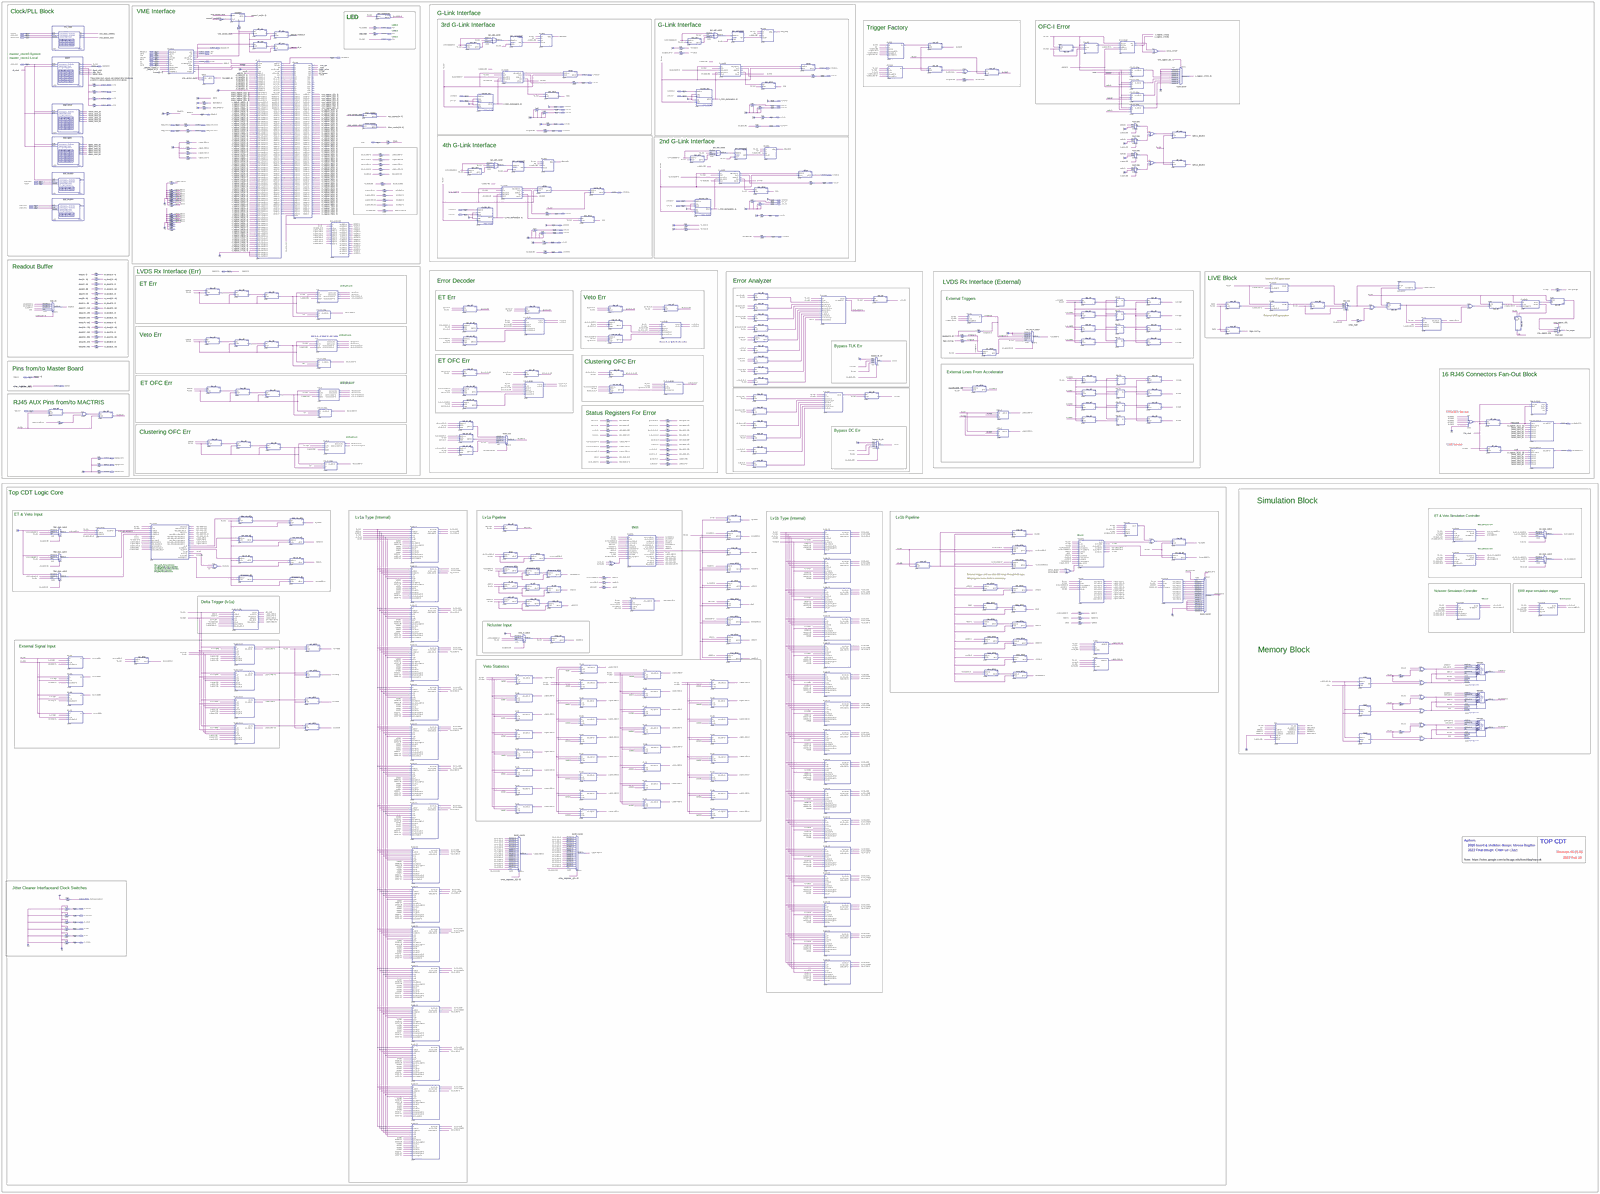
[diagram p0: schematic sheet, whole]
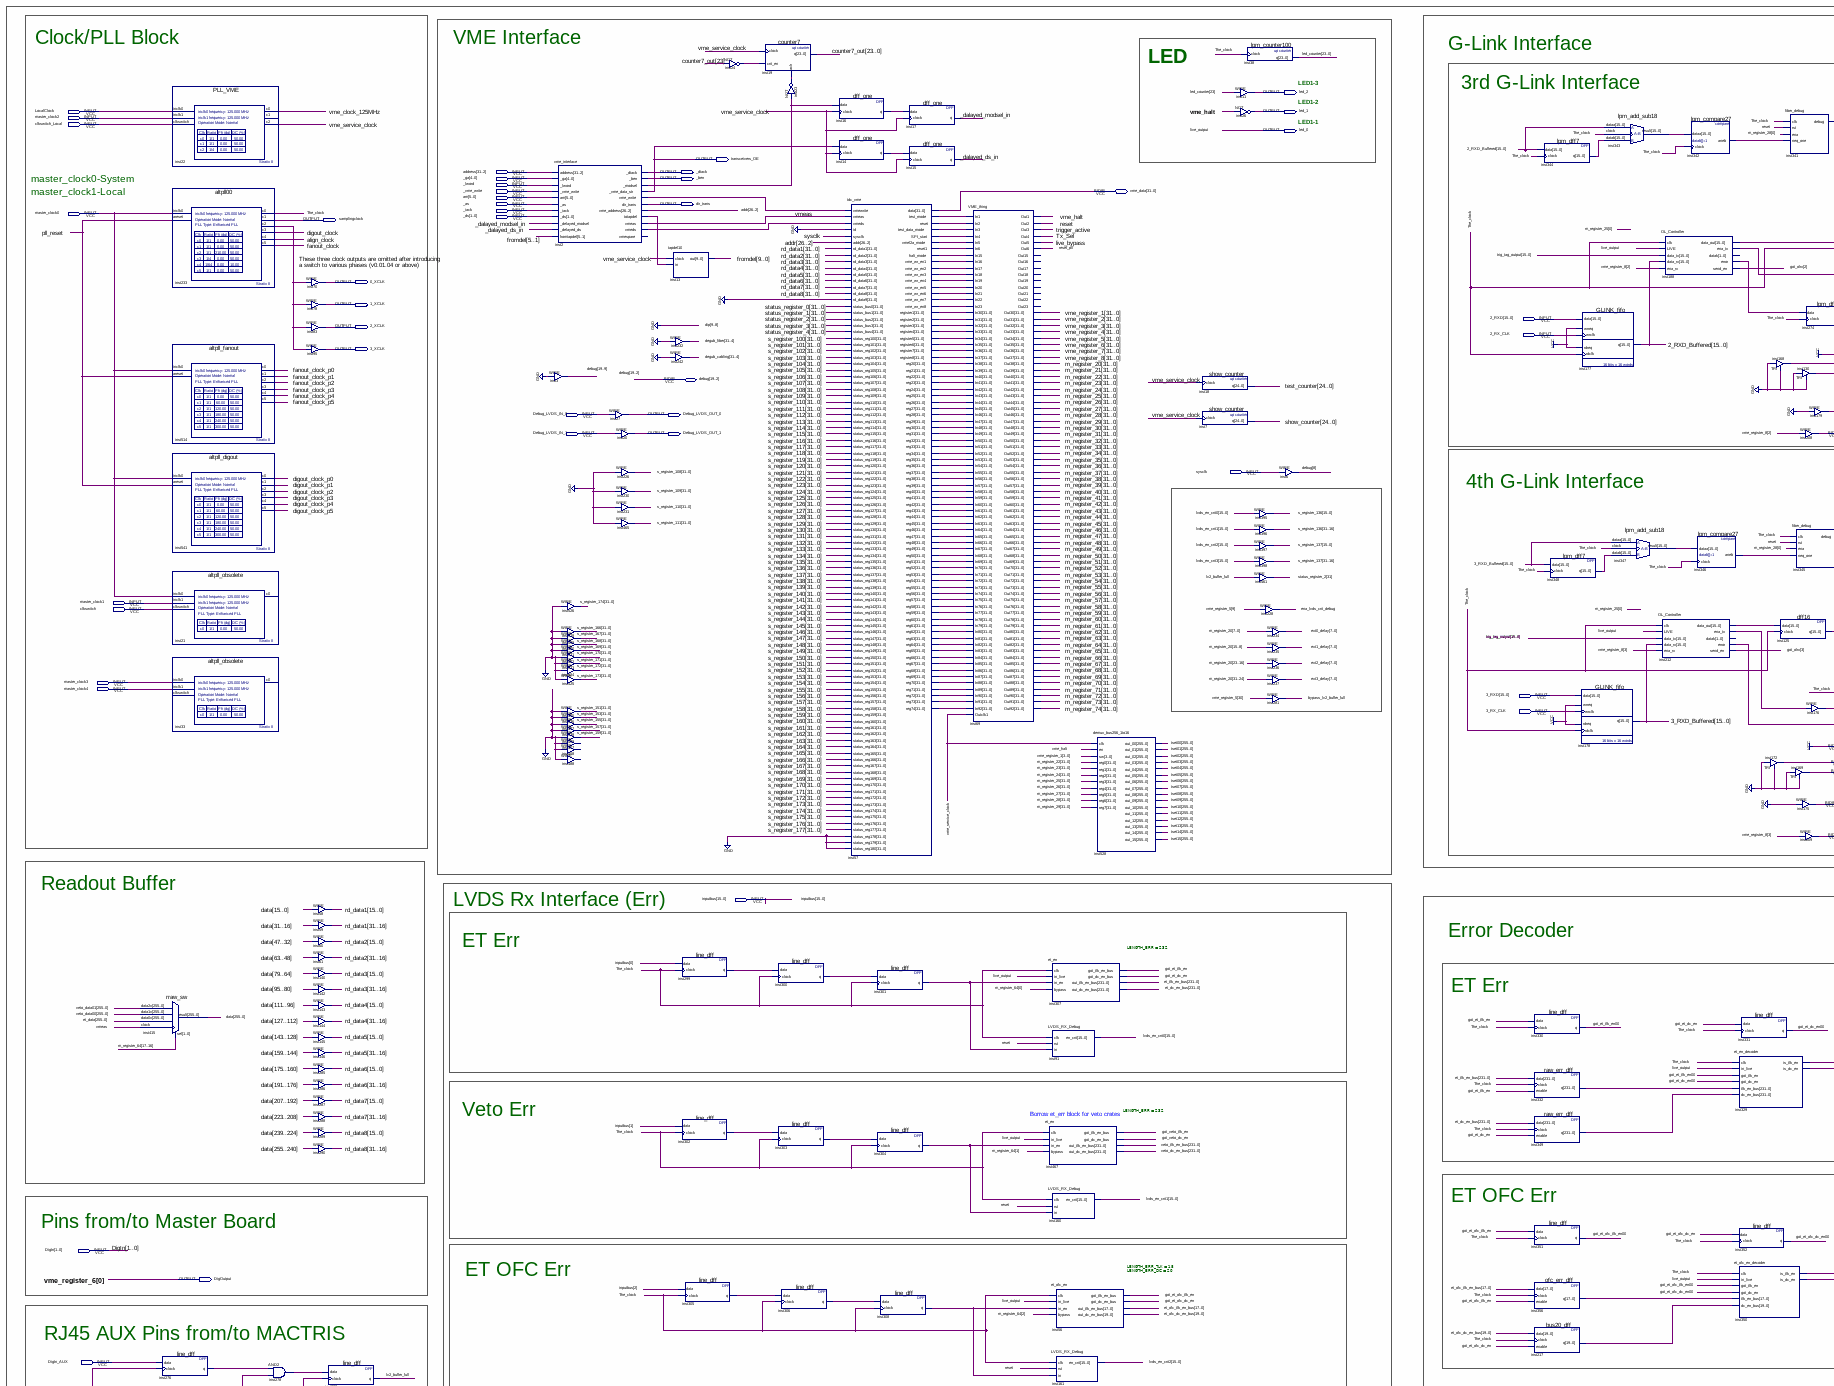
[diagram p1: schematic sheet, upper left part]
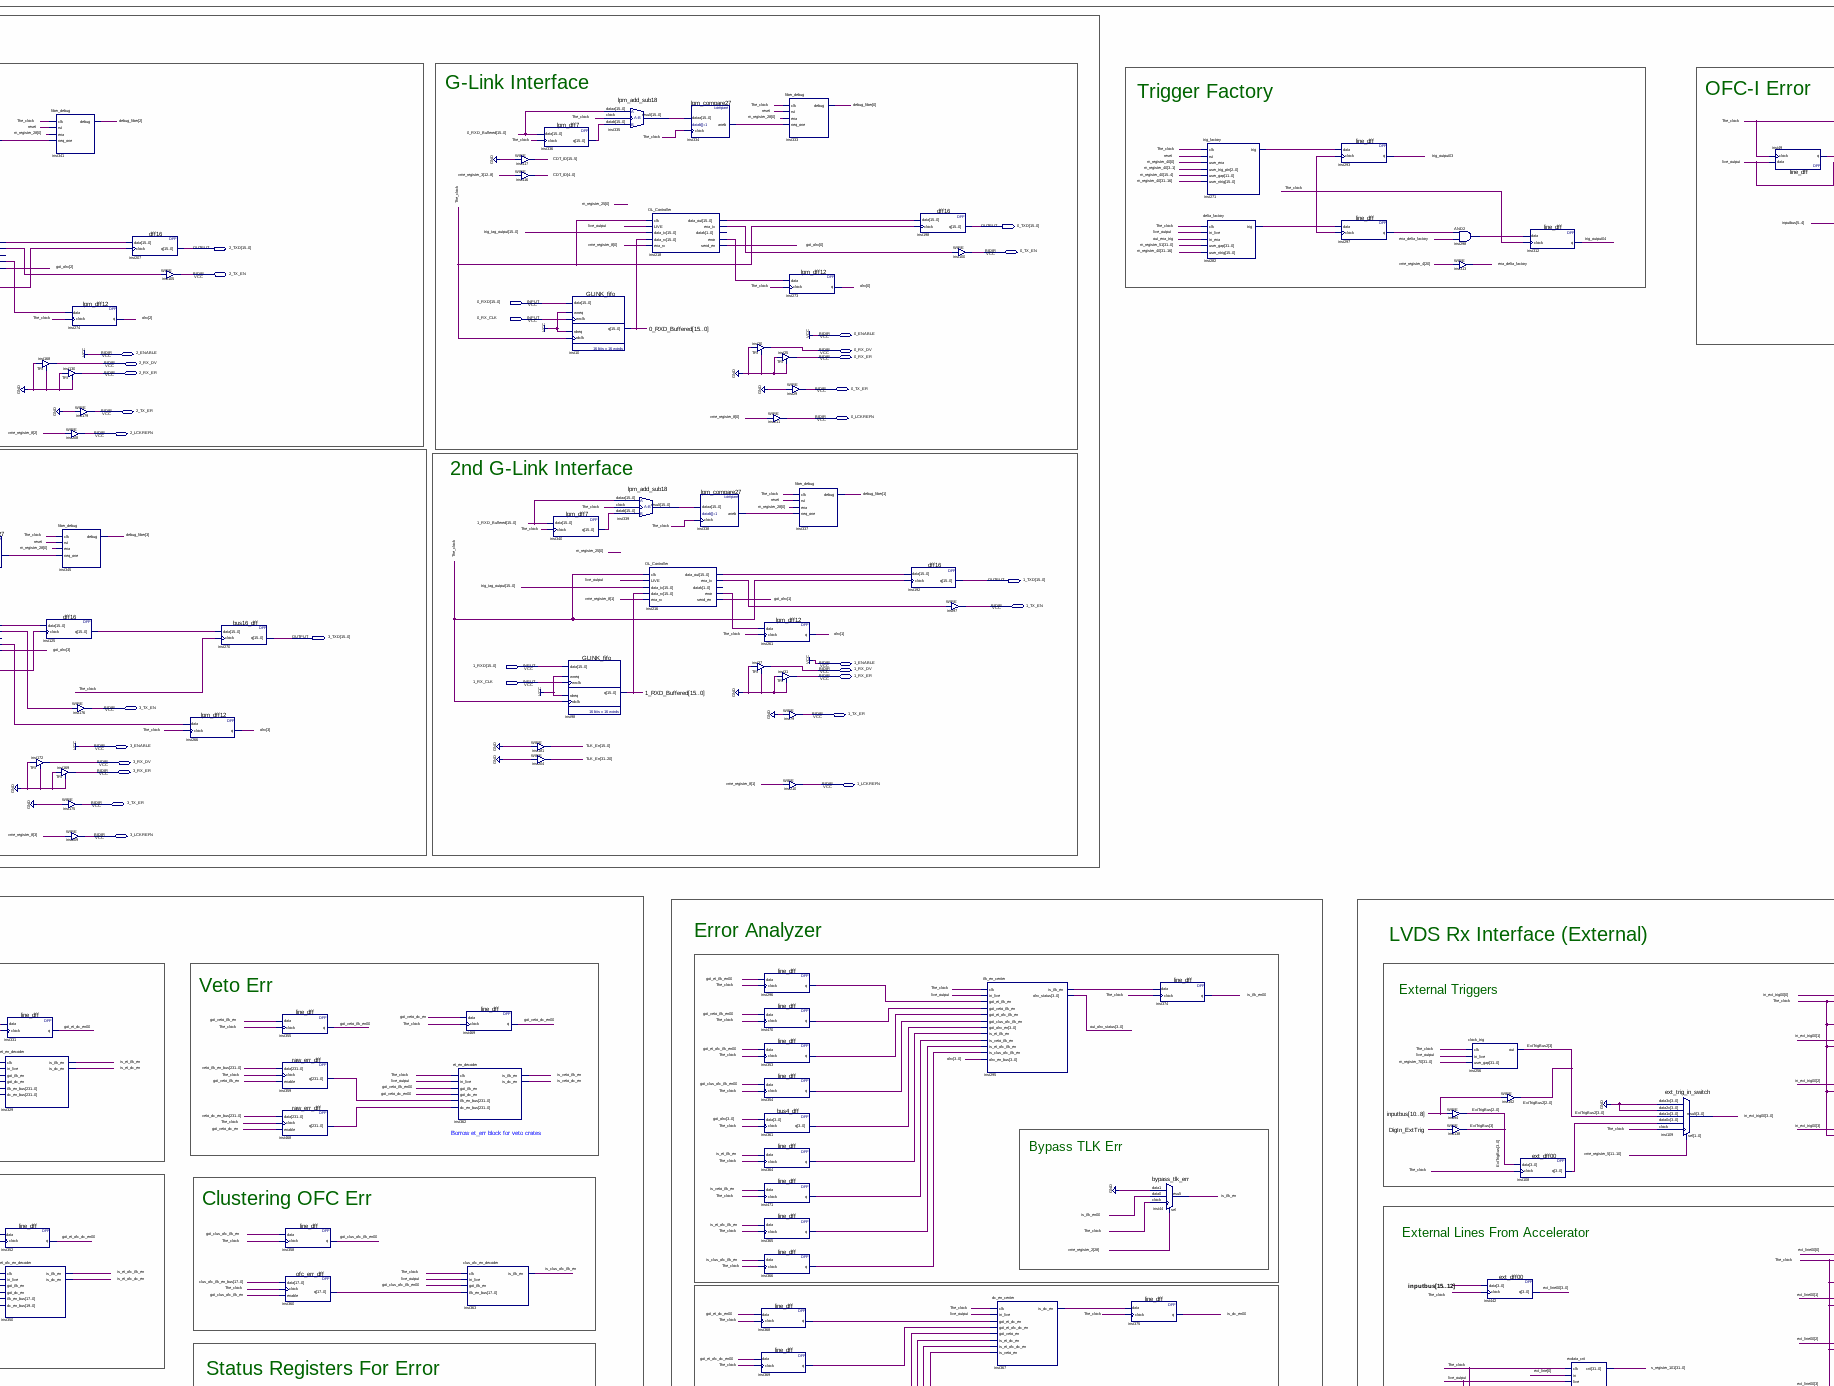
[diagram p2: schematic sheet, upper centre part]
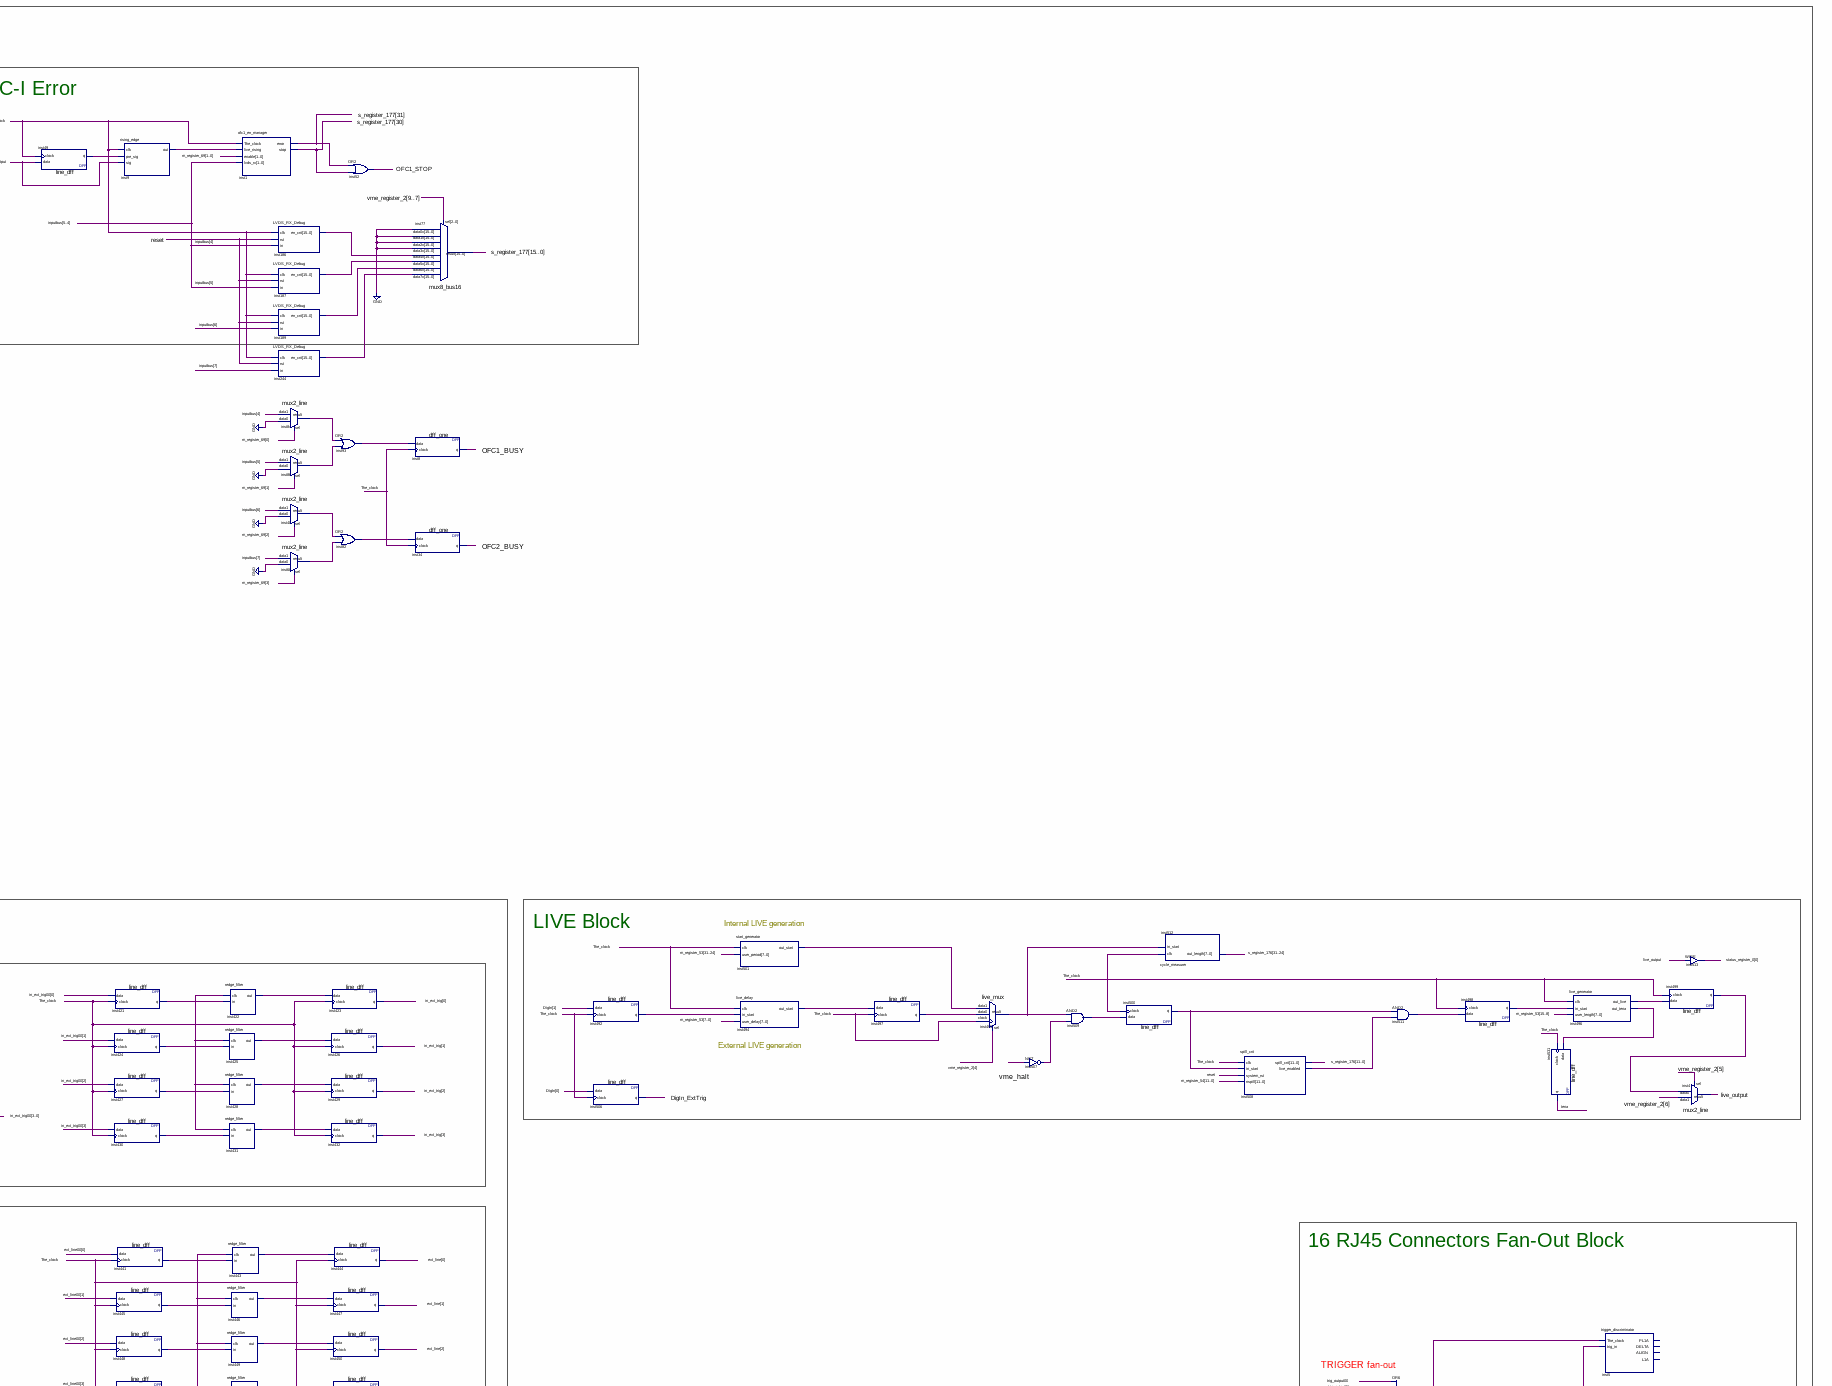
[diagram p3: schematic sheet, upper right part]
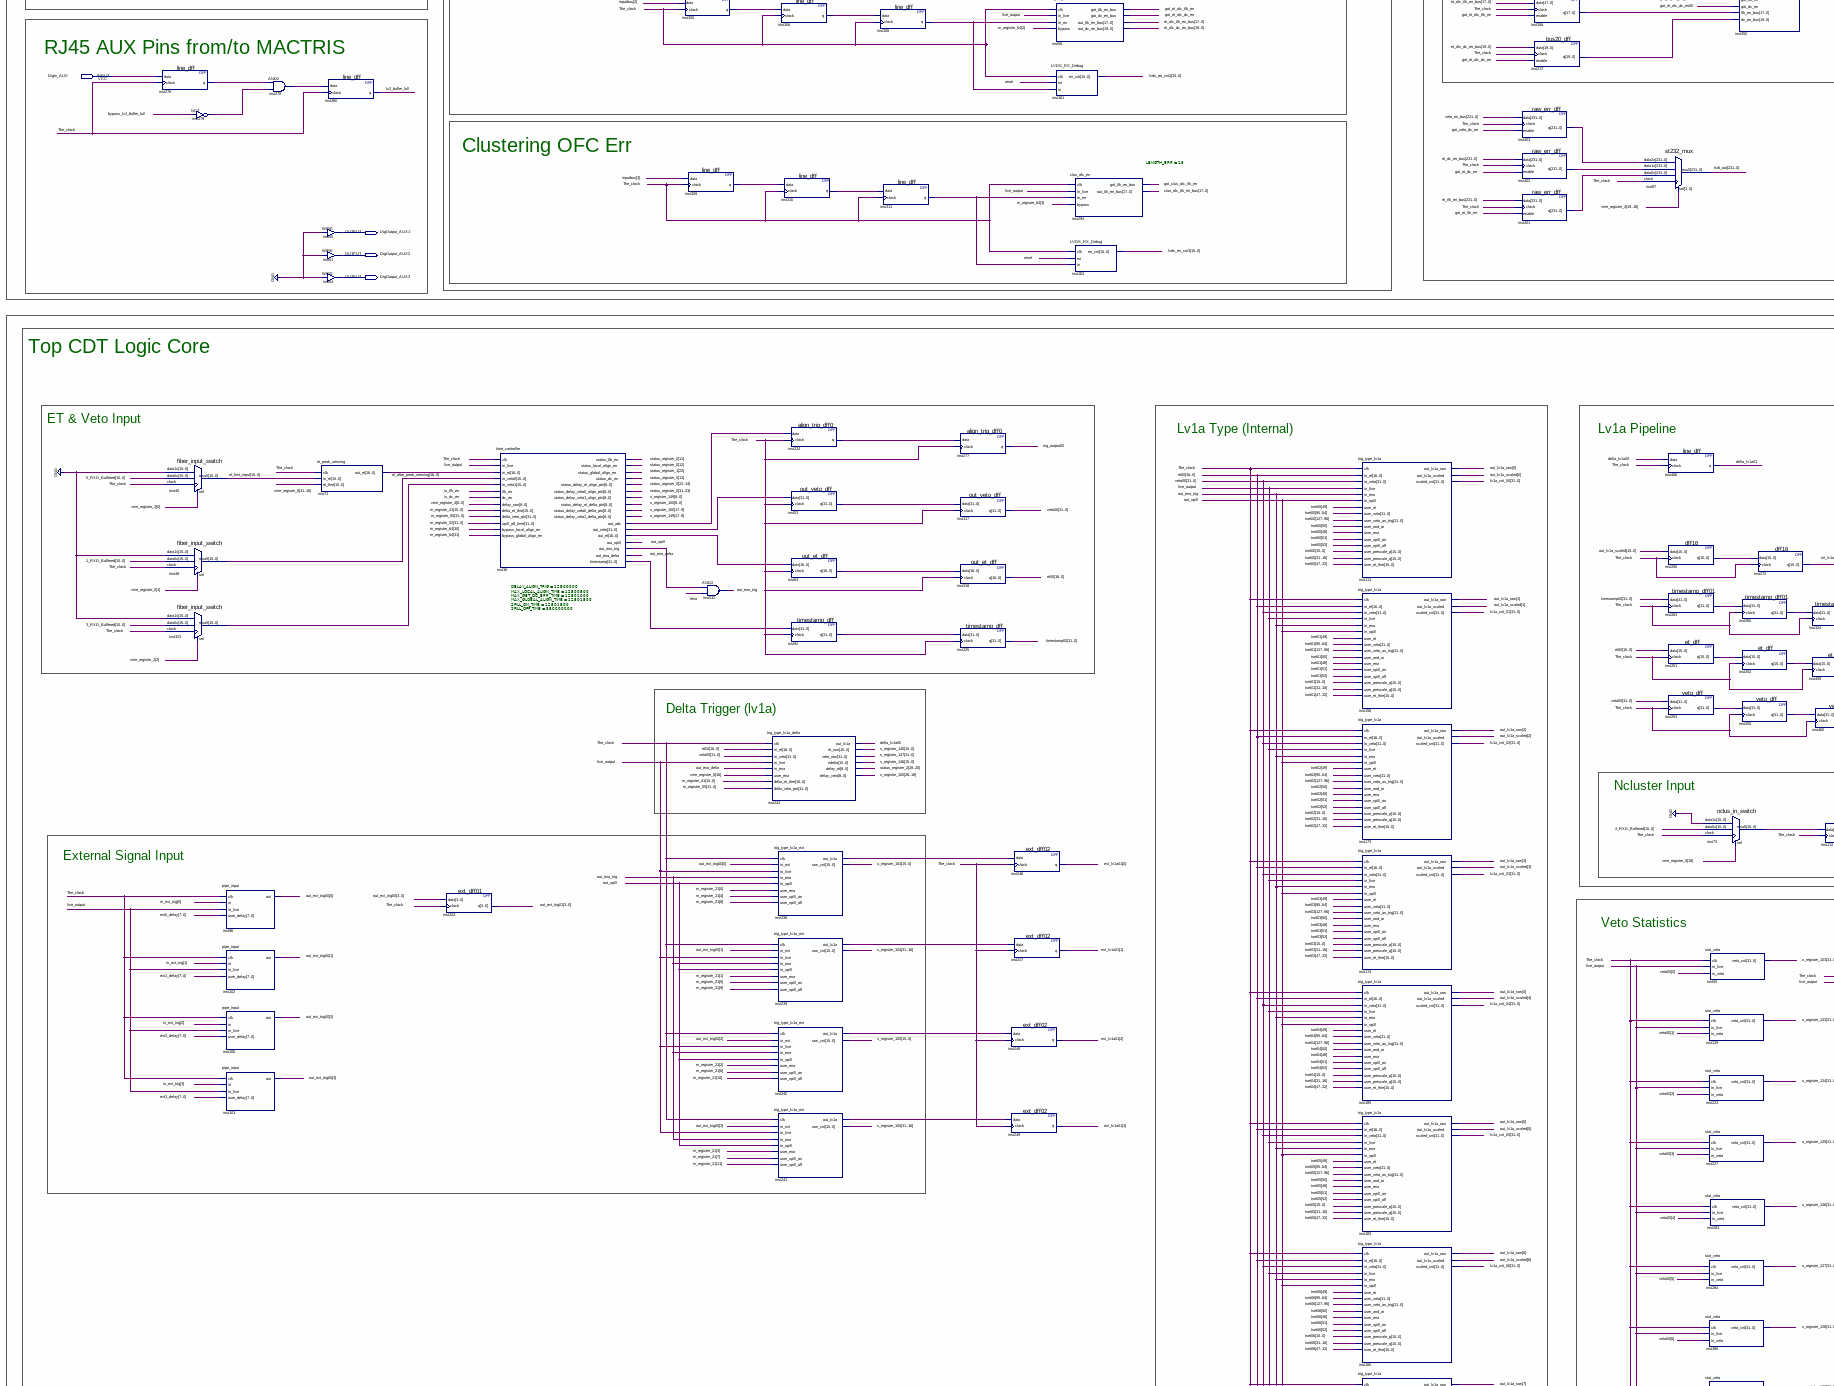
[diagram p4: schematic sheet, middle left part]
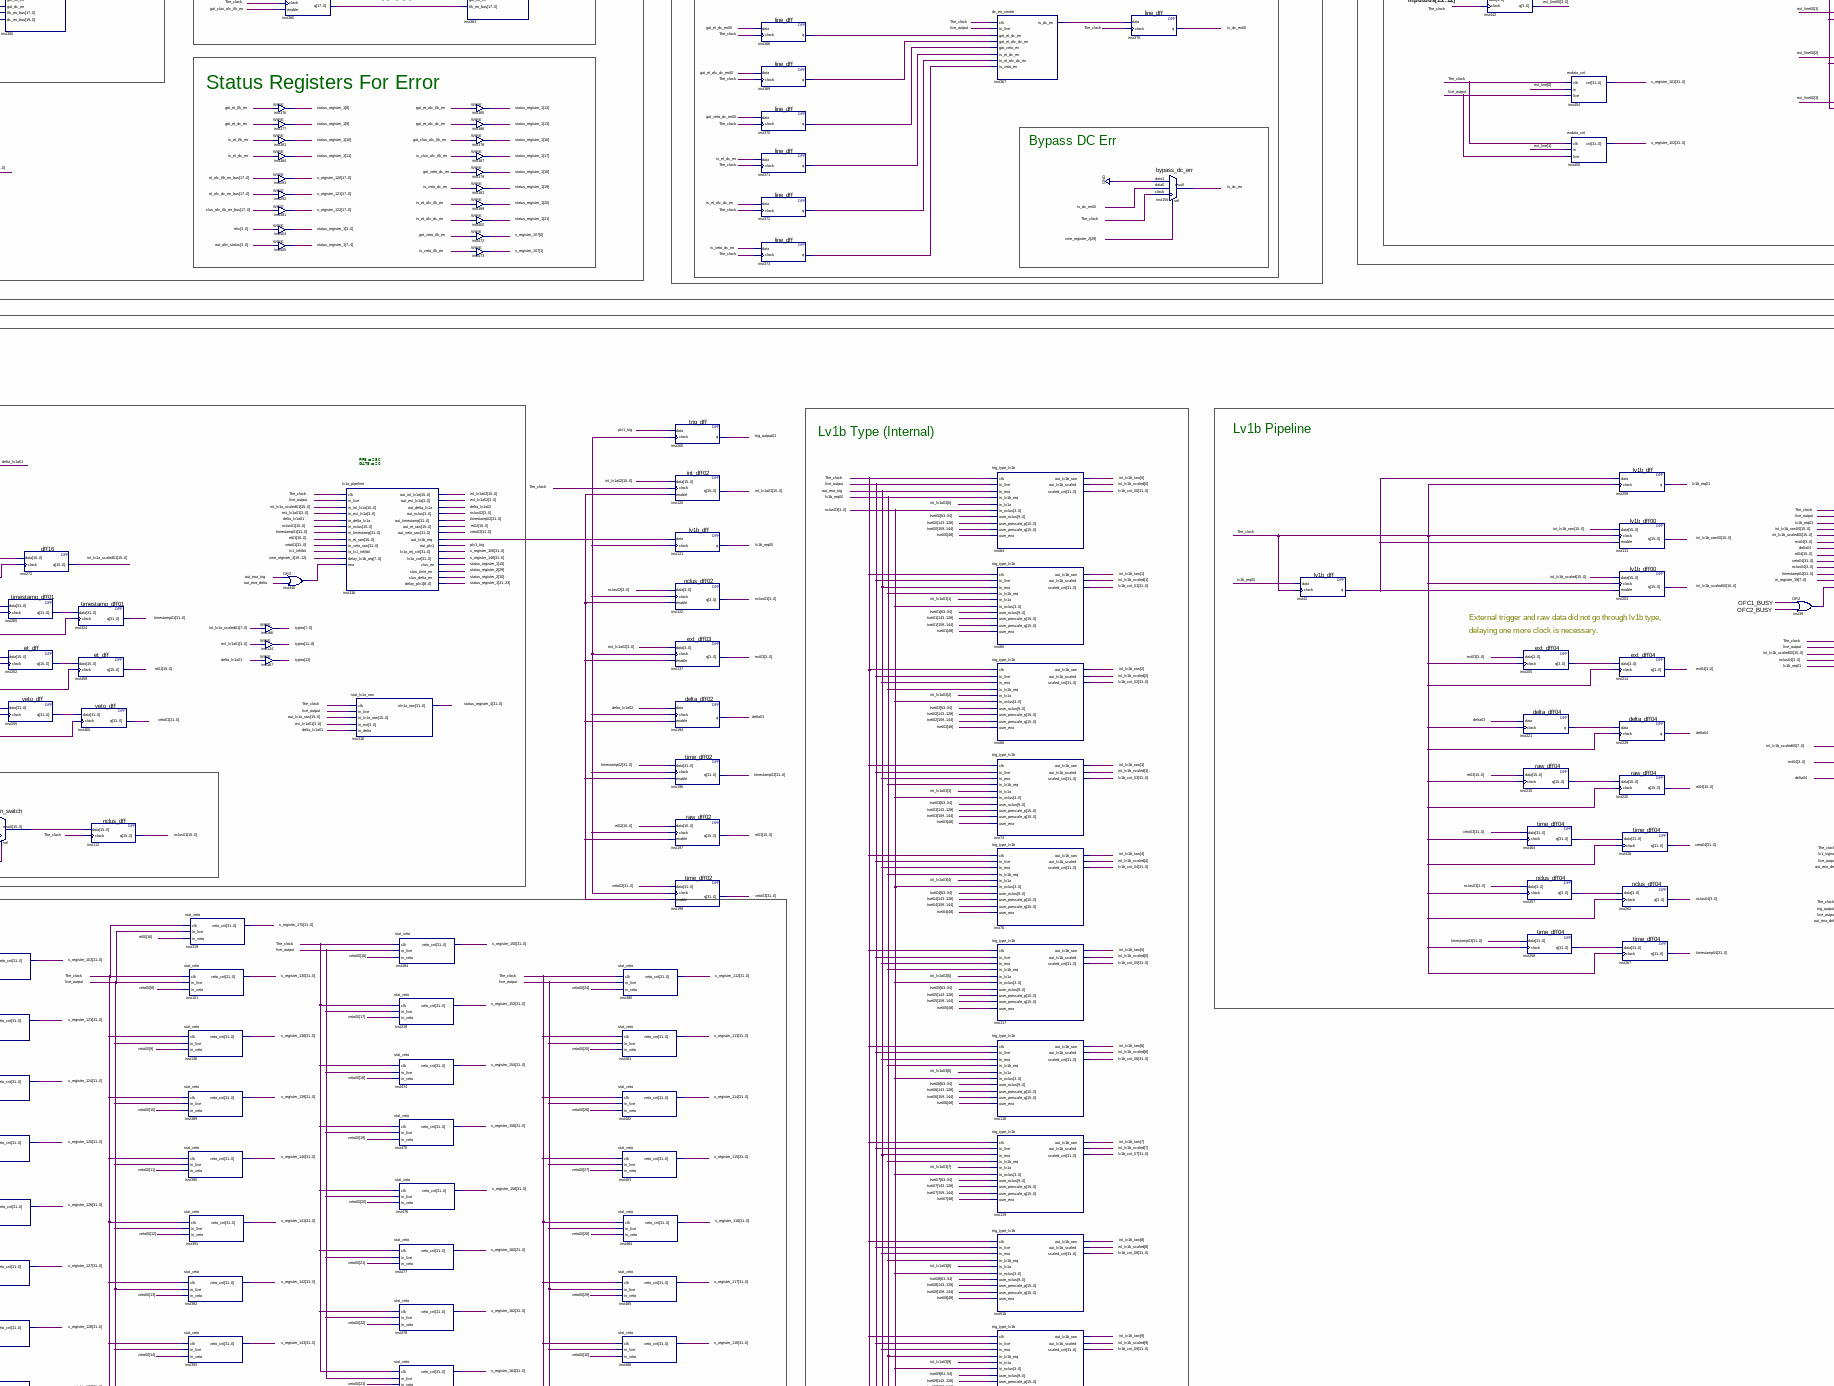
[diagram p5: schematic sheet, middle centre part]
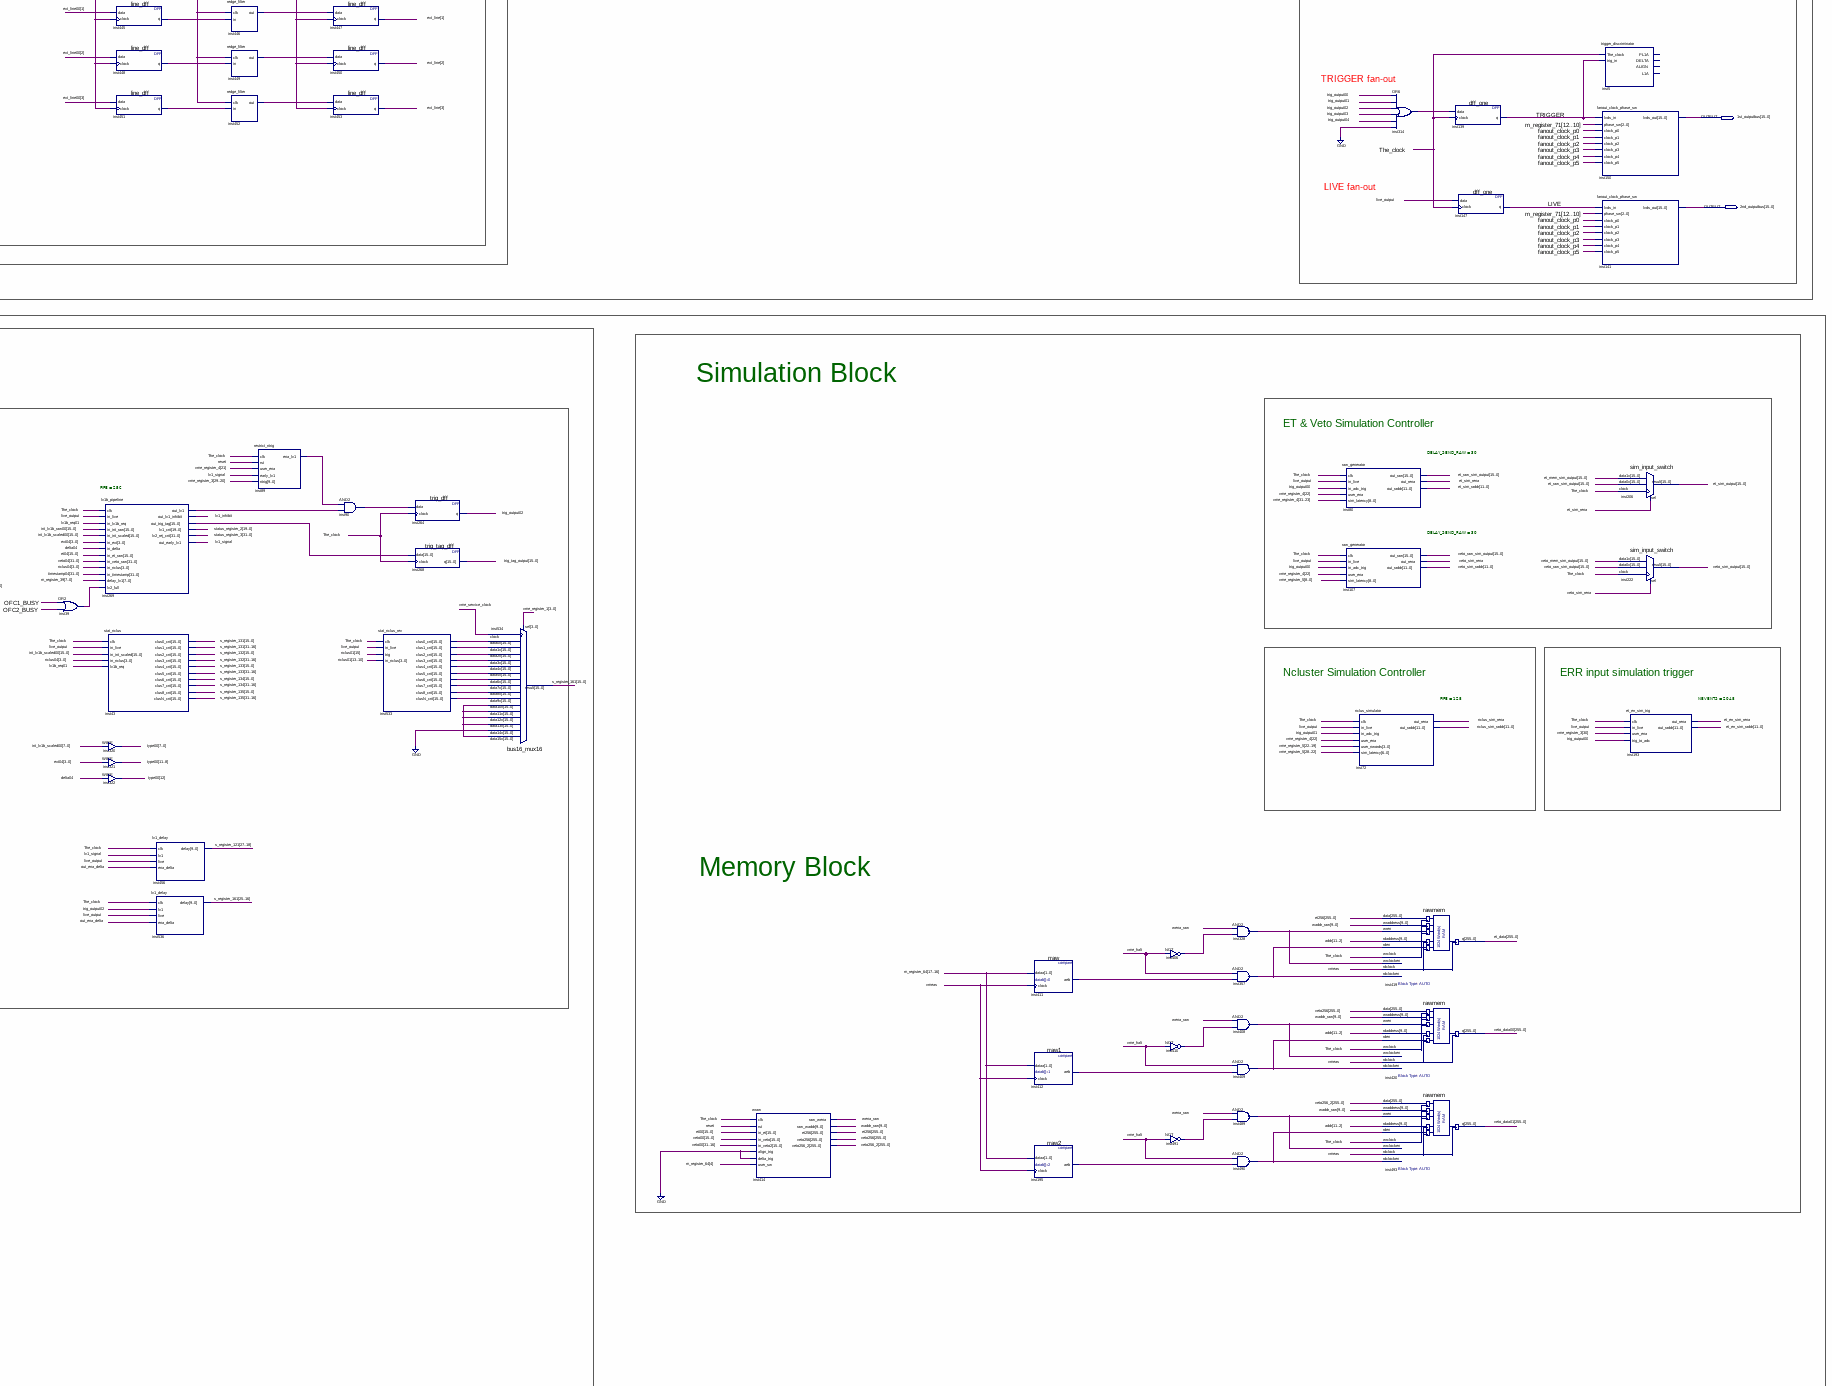
[diagram p6: schematic sheet, middle right part]
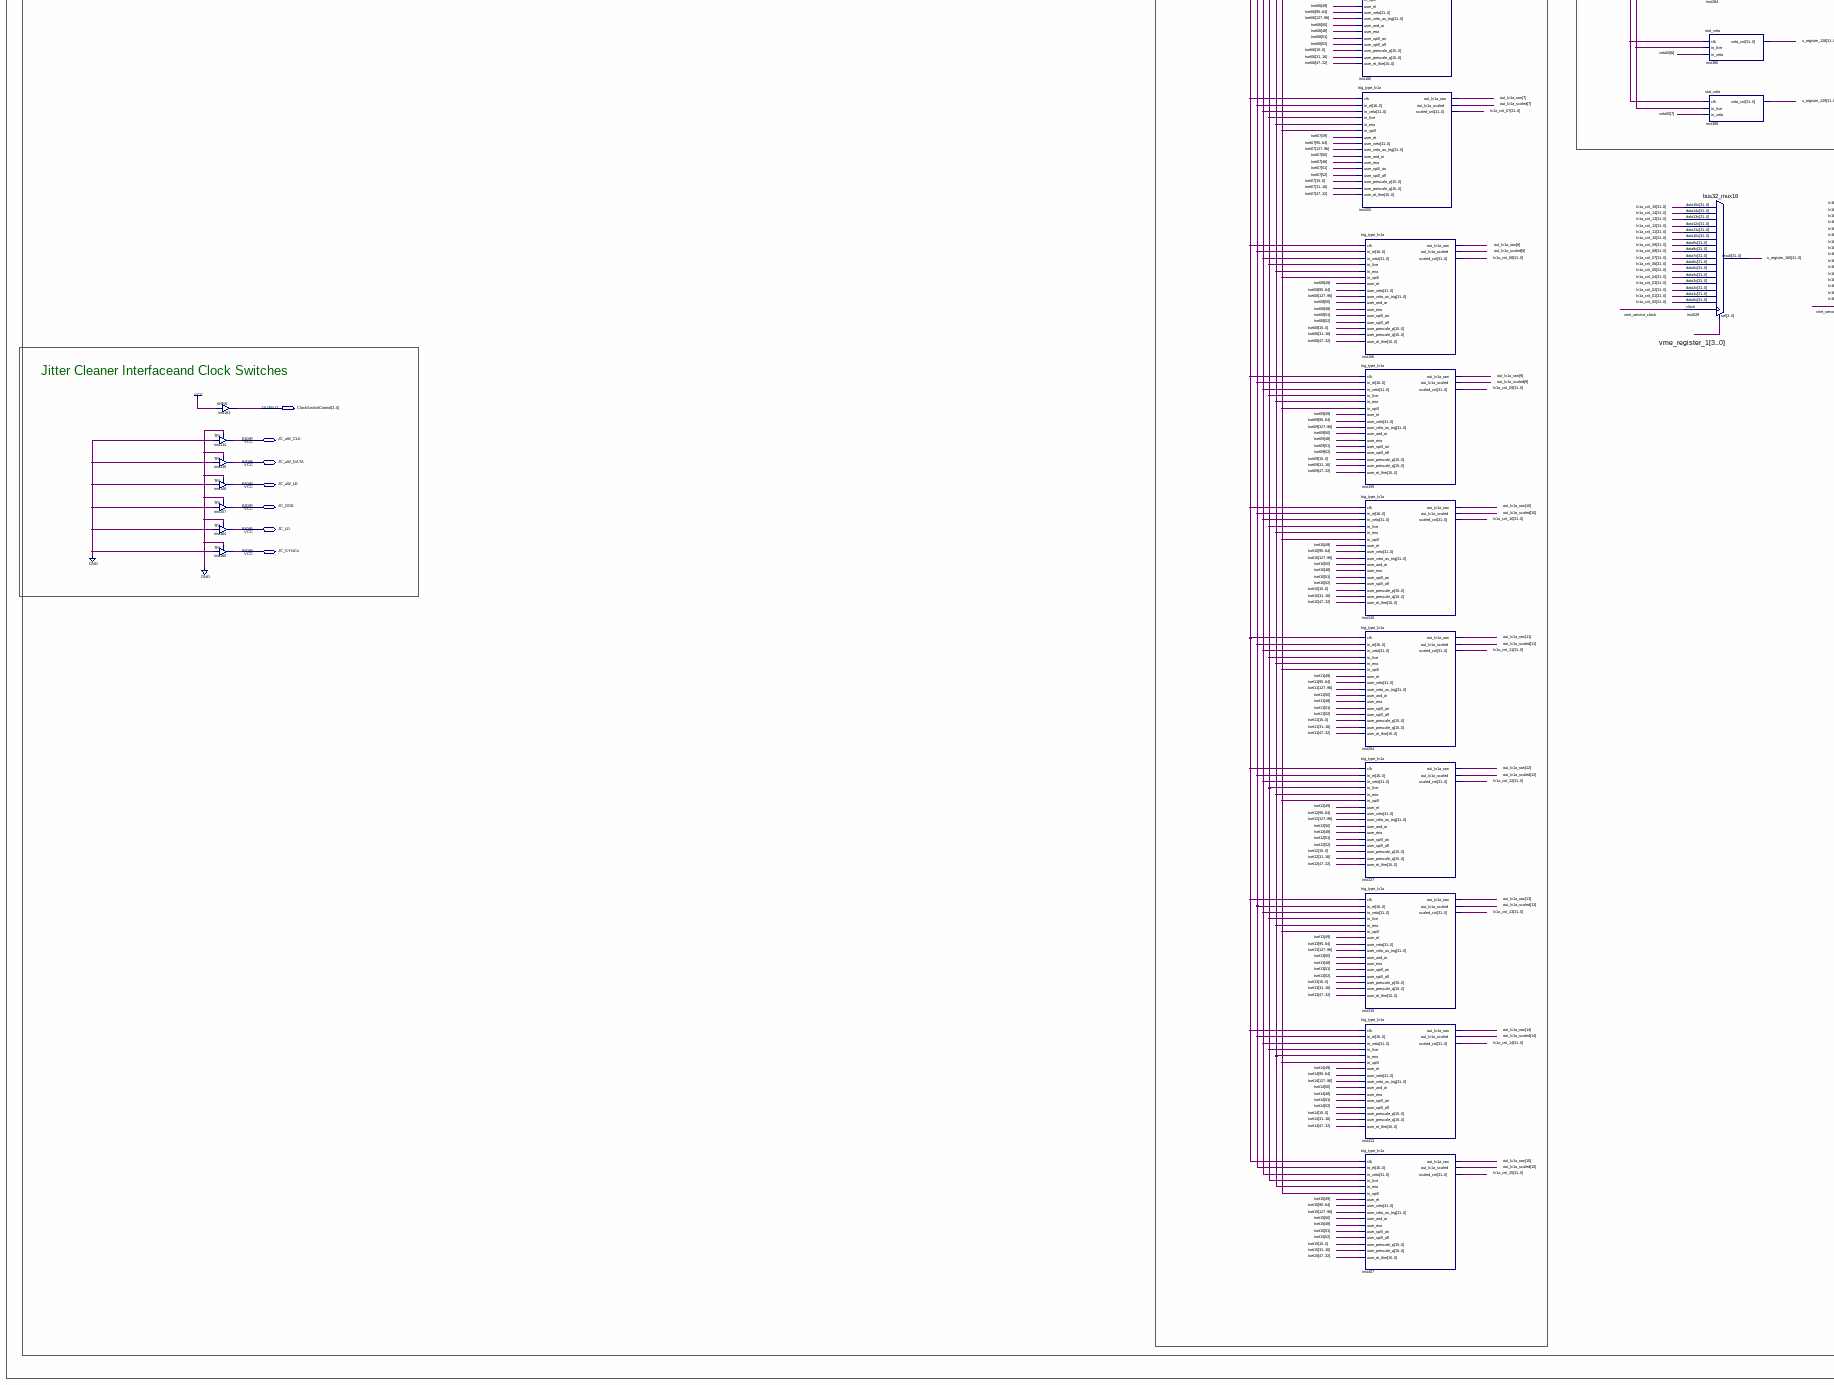
[diagram p7: schematic sheet, lower left part]
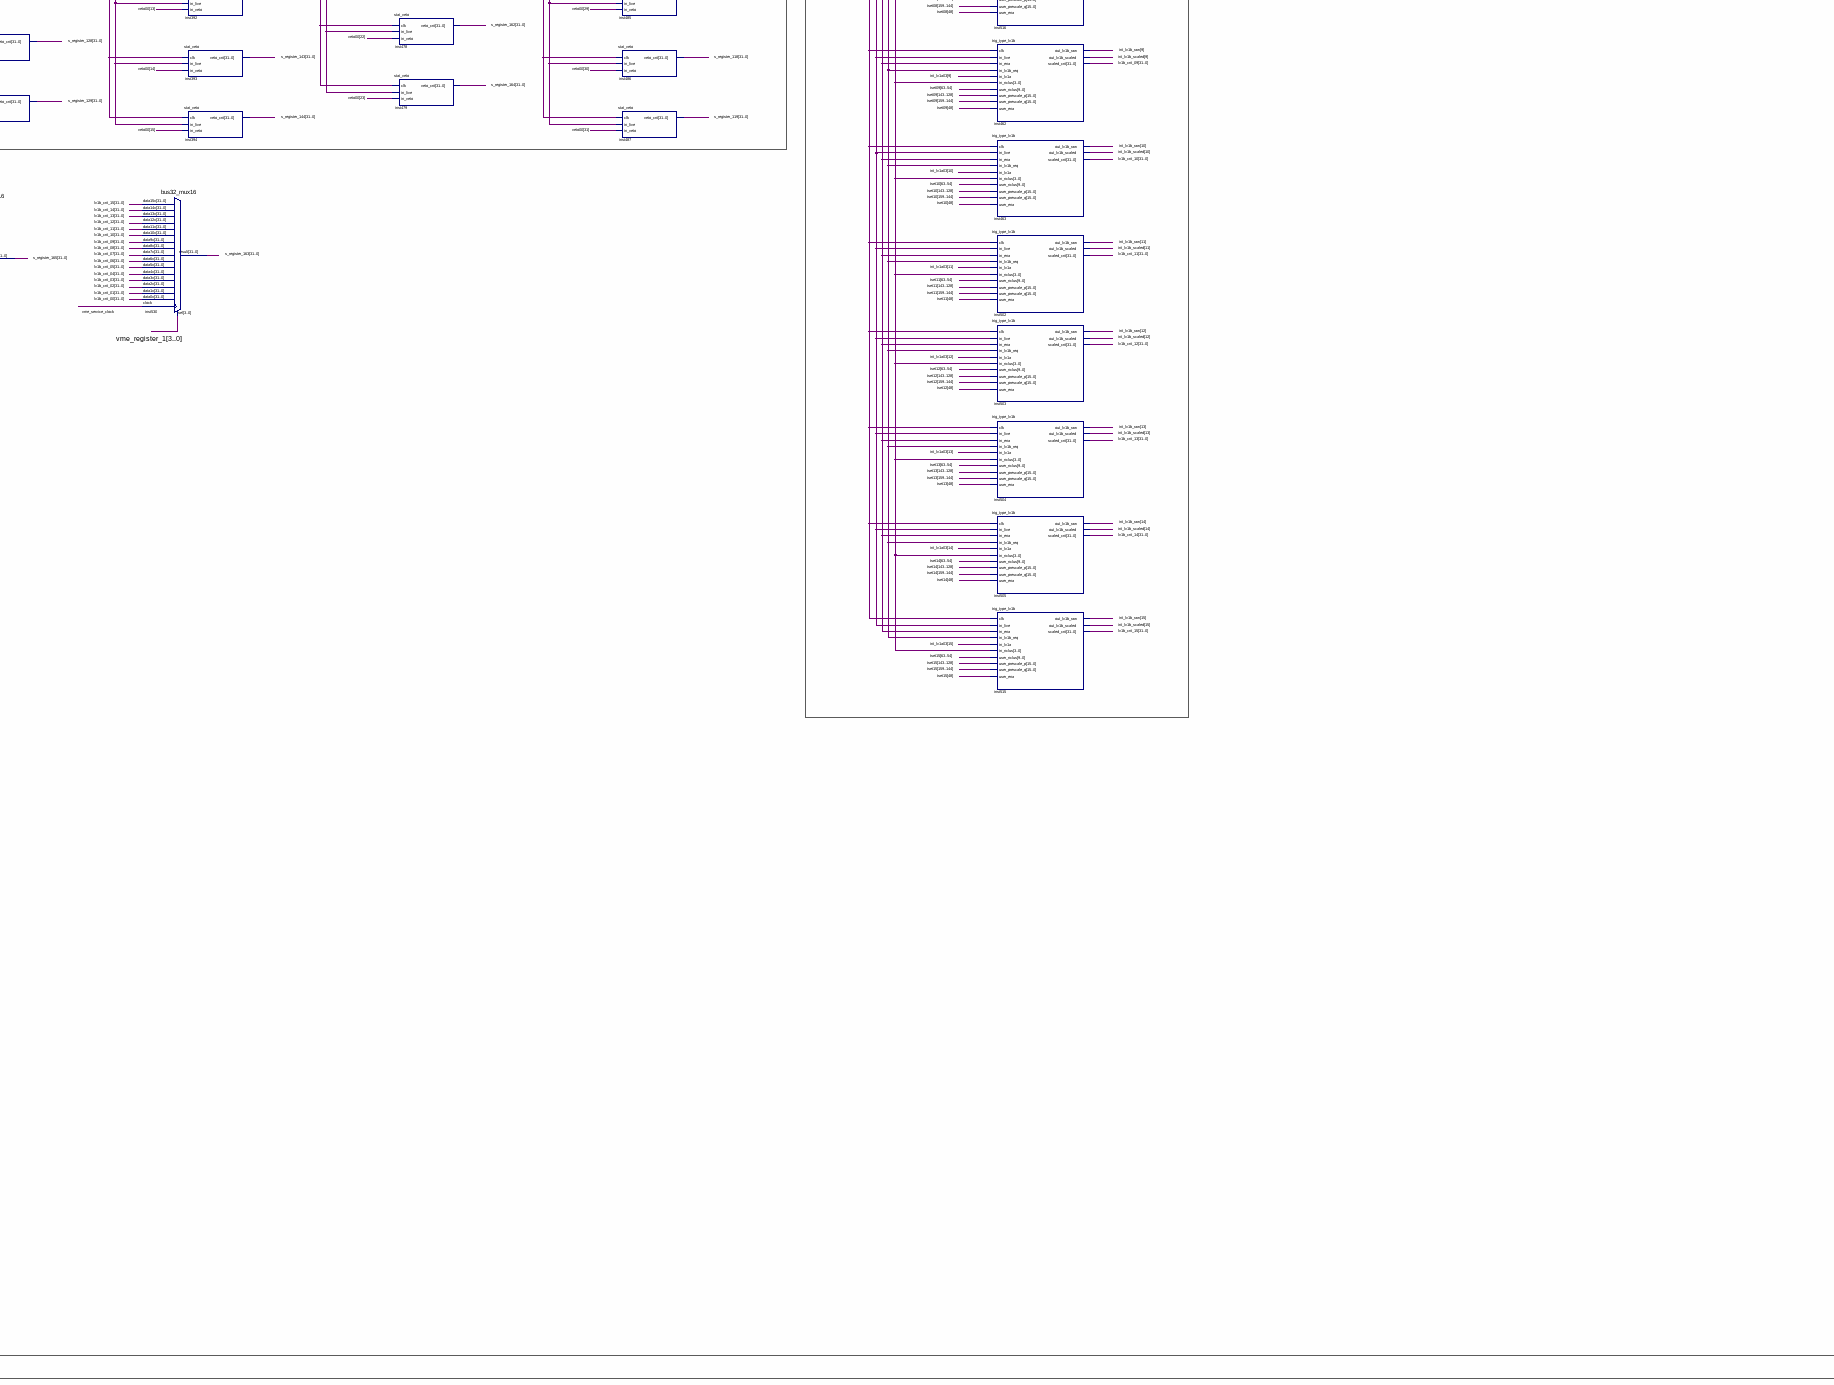
[diagram p8: schematic sheet, lower centre part]
// Quartus schematic sigma_delta.bdf as structural Verilog: 492 symbols, 87 pins
module sigma_delta (
  input  LocalClock,
  input  master_clock2,
  input  clkswitch_Local,
  input  [31:2] address,
  input  [4:0] _ga,
  input  _lword,
  input  _vme_write,
  input  [5:0] am,
  input  _as,
  input  _iack,
  input  master_clock0,
  input  [1:0] _ds,
  input  [15:0] \0_RXD ,
  input  [15:0] \2_RXD ,
  input  \0_RX_CLK ,
  input  \2_RX_CLK ,
  input  Debug_LVDS_IN_0,
  input  Debug_LVDS_IN_1,
  input  sysclk,
  input  master_clock1,
  input  clkswitch,
  input  [15:0] \1_RXD ,
  input  master_clock3,
  input  \1_RX_CLK ,
  input  master_clock4,
  input  [15:0] \3_RXD ,
  input  \3_RX_CLK ,
  input  [15:0] inputbus,
  input  [1:0] DigIn,
  input  DigIn_AUX,
  inout  [31:0] vme_data,
  inout  \0_TX_EN ,
  inout  \2_TX_EN ,
  inout  \0_ENABLE ,
  inout  \0_RX_DV ,
  inout  \2_ENABLE ,
  inout  \0_RX_ER ,
  inout  \2_RX_DV ,
  inout  \2_RX_ER ,
  inout  [19:2] debug,
  inout  \0_TX_ER ,
  inout  \2_TX_ER ,
  inout  \0_LCKREFN ,
  inout  \2_LCKREFN ,
  inout  \1_TX_EN ,
  inout  \1_ENABLE ,
  inout  \1_RX_DV ,
  inout  \1_RX_ER ,
  inout  \3_TX_EN ,
  inout  \1_TX_ER ,
  inout  \3_ENABLE ,
  inout  \3_RX_DV ,
  inout  \3_RX_ER ,
  inout  \1_LCKREFN ,
  inout  \3_TX_ER ,
  inout  \3_LCKREFN ,
  inout  JC_uW_CLK,
  inout  JC_uW_DATA,
  inout  JC_uW_LE,
  inout  JC_GOE,
  inout  JC_LD,
  inout  JC_SYNCn,
  output led_2,
  output led_1,
  output led_0,
  output transceivers_OE,
  output _dtack,
  output _berr,
  output dir_trans,
  output samplingclock,
  output [15:0] \0_TXD ,
  output [15:0] \2_TXD ,
  output \0_XCLK ,
  output \1_XCLK ,
  output \2_XCLK ,
  output \3_XCLK ,
  output Debug_LVDS_OUT_0,
  output Debug_LVDS_OUT_1,
  output [15:0] \1_TXD ,
  output [15:0] \3_TXD ,
  output DigOutput,
  output [15:0] \1st_outputbus ,
  output [15:0] \2nd_outputbus ,
  output DigOutput_AUX1,
  output DigOutput_AUX2,
  output DigOutput_AUX3,
  output [3:0] ClockSwitchControl
);

  wire _dalayed_ds_in, _dalayed_modsel_in, align_clock, bypass_lv2_buffer_full, delta03, delta04,
       delta_lv1a00, delta_lv1a01, delta_lv1a02, DigIn_ExtTrig, digout_clock, digout_clock_p0,
       digout_clock_p1, digout_clock_p2, digout_clock_p3, digout_clock_p4, digout_clock_p5,
       ena_delta_factory, ena_lvds_cnt_debug, et_err_sim_rena, et_sim_rena, fanout_clock, fanout_clock_p0,
       fanout_clock_p1, fanout_clock_p2, fanout_clock_p3, fanout_clock_p4, fanout_clock_p5,
       got_clus_ofc_tlk_err, got_clus_ofc_tlk_err00, got_et_dc_err, got_et_dc_err00, got_et_ofc_dc_err,
       got_et_ofc_dc_err00, got_et_ofc_tlk_err, got_et_ofc_tlk_err00, got_et_tlk_err, got_et_tlk_err00,
       got_veto_dc_err, got_veto_dc_err00, got_veto_tlk_err, got_veto_tlk_err00, inst2__modsel,
       inst2_totapdel, inst2_vme_write, inst2_vmeds, inst9_out, inst14_q, inst16_q, inst23_out, inst24_out,
       inst36_out_adc, inst36_out_ena_trig, inst39_out, inst40_result, inst42_q, inst49_q, inst57_halt_mode,
       inst57_reset, inst57_reset1, inst57_spi_start, inst57_test_data_mode, inst57_test_mode,
       inst57_vme_wr_en1, inst57_vme_wr_en2, inst57_vme_wr_en3, inst57_vme_wr_en4, inst57_vme_wr_en5,
       inst57_vme_wr_en6, inst57_vme_wr_en7, inst57_vme_wr_en8, inst57_vmel2a_mode, inst68_result,
       inst82_out, inst84_result, inst86_result, inst89_ena_lv1, inst90_out, inst93_out,
       inst116_out_lv1b_req, inst188_ena_tx, inst188_error, inst195_aeb, inst212_ena_tx, inst212_error,
       inst216_ena_tx, inst216_error, inst218_ena_tx, inst218_error, inst221_q, inst224_q, inst233_c2,
       inst238_out_lv1a, inst239_out_lv1a, inst240_out_lv1a, inst241_out_lv1a, inst269_out_lv1, inst271_trig,
       inst276_q, inst278_out, inst279_out, inst282_trig, inst295_is_tlk_err, inst296_q, inst297_q,
       inst298_out, inst299_q, inst300_q, inst301_q, inst302_q, inst303_q, inst304_q, inst305_q, inst306_q,
       inst308_q, inst309_q, inst310_q, inst311_q, inst314_out, inst328_out, inst334_aneb, inst338_aneb,
       inst342_aneb, inst346_aneb, inst353_q, inst354_q, inst357_out, inst364_q, inst365_q, inst366_q,
       inst367_is_dc_err, inst368_q, inst369_q, inst370_q, inst371_q, inst372_q, inst373_q, inst406_out,
       inst408_out, inst409_out, inst410_out, inst411_aeb, inst412_aeb, inst421_q, inst422_out, inst424_q,
       inst425_out, inst427_q, inst428_out, inst430_q, inst431_out, inst440_out, inst441_q, inst443_out,
       inst445_q, inst446_out, inst448_q, inst449_out, inst451_q, inst452_out, inst470_q, inst471_q,
       inst489_out, inst490_out, inst491_out, inst492_q, inst494_out_start, inst495_result, inst496_out_live,
       inst496_out_tena, inst497_q, inst498_q, inst499_q, inst500_q, inst501_out_start, inst507_out,
       inst508_live_enabled, inst509_out, inst511_out, is_clus_ofc_tlk_err, is_dc_err, is_dc_err00,
       is_et_dc_err, is_et_ofc_dc_err, is_et_ofc_tlk_err, is_et_tlk_err, is_tlk_err, is_tlk_err00,
       is_veto_dc_err, is_veto_tlk_err, LIVE, live_bypass, lv1_inhibit, lv1_signal, lv1b_req00, lv1b_req01,
       lv2_buffer_full, nclus_sim_rena, OFC1_BUSY, OFC1_STOP, OFC2_BUSY, out_ena_delta, out_ena_trig,
       out_spill, pll_reset, plv1_trig, reset, reset_pll, tena, The_clock, trig_output00, trig_output01,
       trig_output02, trig_output03, trig_output04, TRIGGER, trigger_active, Tx_Sel, veto_sim_rena,
       vme_clock_125MHz, vme_halt, vme_service_clock, vmeas, wena_raw;
  wire [3:0] debug_fiber, ext03, ext04, ext_line, ext_line00, ext_lv1a01, ext_lv1a02, ExtTrigBus,
       ExtTrigBus2, got_olrx, in_ext_trig, in_ext_trig00, inst108_q, inst205_q, inst257_q, inst361_q,
       nclus02, nclus03, nclus04, olrx, out_ext_trig00, out_ext_trig01, out_olrx_status;
  wire [7:0] ext0_delay, ext1_delay, ext2_delay, ext3_delay;
  wire [9:0] fromdel, waddr_raw;
  wire [11:0] et_err_sim_raddr, et_sim_raddr, nclus_sim_raddr, veto_sim_raddr;
  wire [12:0] type00, typea;
  wire [15:0] \0_RXD_Buffered , \1_RXD_Buffered , \2_RXD_Buffered , \3_RXD_Buffered , CDT_ID, et01, et02,
       et03, et04, et_first_input, et_mem_sim_output, et_raw_sim_output, et_sim_output, inst48_result,
       inst73_result, inst125_q, inst186_err_cnt, inst187_err_cnt, inst188_data_out, inst189_err_cnt,
       inst212_data_out, inst215_q, inst216_data_out, inst218_data_out, inst244_err_cnt, inst250_q,
       inst251_q, inst252_q, inst269_out_trig_tag, inst323_result, inst335_result, inst336_q, inst339_result,
       inst340_q, inst343_result, inst344_q, inst347_result, inst348_q, inst533_clus0_cnt, inst533_clus1_cnt,
       inst533_clus2_cnt, inst533_clus3_cnt, inst533_clus4_cnt, inst533_clus5_cnt, inst533_clus6_cnt,
       inst533_clus7_cnt, inst533_clus8_cnt, inst533_clusn_cnt, int_lv1a02, int_lv1a03, int_lv1a_scaled01,
       int_lv1b_raw, int_lv1b_raw00, int_lv1b_scaled, int_lv1b_scaled00, lvds_err_cnt0, lvds_err_cnt1,
       lvds_err_cnt2, lvds_err_cnt3, nclus01, out_lv1a_raw, out_lv1a_scaled, trig_tag_output,
       veto_mem_sim_output, veto_raw_sim_output, veto_sim_output;
  wire [16:0] et00, et_after_peak_sensing, inst36_out_et, inst63_q;
  wire [17:0] clus_ofc_tlk_err_bus, et_ofc_tlk_err_bus, inst356_q, inst360_q;
  wire [19:0] et_ofc_dc_err_bus, inst217_q;
  wire [23:0] counter7_out, led_counter;
  wire [24:0] show_counter, test_counter;
  wire [26:2] addr;
  wire [31:0] inst36_out_veto, inst36_timestamp, inst53_q, inst57_reg20, inst57_reg21, inst57_reg22,
       inst57_reg23, inst57_reg24, inst57_reg25, inst57_reg26, inst57_reg27, inst57_reg28, inst57_reg29,
       inst57_reg30, inst57_reg31, inst57_reg32, inst57_reg33, inst57_reg34, inst57_reg35, inst57_reg36,
       inst57_reg37, inst57_reg38, inst57_reg39, inst57_reg40, inst57_reg41, inst57_reg42, inst57_reg43,
       inst57_reg44, inst57_reg45, inst57_reg46, inst57_reg47, inst57_reg48, inst57_reg49, inst57_reg50,
       inst57_reg51, inst57_reg52, inst57_reg53, inst57_reg54, inst57_reg55, inst57_reg56, inst57_reg57,
       inst57_reg58, inst57_reg59, inst57_reg60, inst57_reg61, inst57_reg62, inst57_reg63, inst57_reg64,
       inst57_reg65, inst57_reg66, inst57_reg67, inst57_reg68, inst57_reg69, inst57_reg70, inst57_reg71,
       inst57_reg72, inst57_reg73, inst57_reg74, inst57_register1, inst57_register2, inst57_register3,
       inst57_register4, inst57_register5, inst57_register6, inst57_register7, inst57_register8, inst92_q,
       inst253_q, inst255_q, inst258_q, inst263_q, inst265_q, inst464_q, lv1a_cnt_00, lv1a_cnt_01,
       lv1a_cnt_02, lv1a_cnt_03, lv1a_cnt_04, lv1a_cnt_05, lv1a_cnt_06, lv1a_cnt_07, lv1a_cnt_08,
       lv1a_cnt_09, lv1a_cnt_10, lv1a_cnt_11, lv1a_cnt_12, lv1a_cnt_13, lv1a_cnt_14, lv1a_cnt_15,
       lv1b_cnt_00, lv1b_cnt_01, lv1b_cnt_02, lv1b_cnt_03, lv1b_cnt_04, lv1b_cnt_05, lv1b_cnt_06,
       lv1b_cnt_07, lv1b_cnt_08, lv1b_cnt_09, lv1b_cnt_10, lv1b_cnt_11, lv1b_cnt_12, lv1b_cnt_13,
       lv1b_cnt_14, lv1b_cnt_15, m_register_20, m_register_21, m_register_22, m_register_23, m_register_24,
       m_register_25, m_register_26, m_register_27, m_register_28, m_register_29, m_register_30,
       m_register_31, m_register_32, m_register_33, m_register_34, m_register_35, m_register_36,
       m_register_37, m_register_38, m_register_39, m_register_40, m_register_41, m_register_42,
       m_register_43, m_register_44, m_register_45, m_register_46, m_register_47, m_register_48,
       m_register_49, m_register_50, m_register_51, m_register_52, m_register_53, m_register_54,
       m_register_55, m_register_56, m_register_57, m_register_58, m_register_59, m_register_60,
       m_register_61, m_register_62, m_register_63, m_register_64, m_register_65, m_register_66,
       m_register_67, m_register_68, m_register_69, m_register_70, m_register_71, m_register_72,
       m_register_73, m_register_74, rd_data1, rd_data2, rd_data3, rd_data4, rd_data5, rd_data6, rd_data7,
       rd_data8, s_register_100, s_register_101, s_register_102, s_register_103, s_register_104,
       s_register_105, s_register_106, s_register_107, s_register_108, s_register_109, s_register_110,
       s_register_111, s_register_112, s_register_113, s_register_114, s_register_115, s_register_116,
       s_register_117, s_register_118, s_register_119, s_register_120, s_register_121, s_register_122,
       s_register_123, s_register_124, s_register_125, s_register_126, s_register_127, s_register_128,
       s_register_129, s_register_130, s_register_131, s_register_132, s_register_133, s_register_134,
       s_register_135, s_register_136, s_register_137, s_register_138, s_register_139, s_register_140,
       s_register_141, s_register_142, s_register_143, s_register_144, s_register_145, s_register_146,
       s_register_147, s_register_148, s_register_149, s_register_150, s_register_151, s_register_152,
       s_register_153, s_register_154, s_register_155, s_register_156, s_register_157, s_register_158,
       s_register_159, s_register_160, s_register_161, s_register_162, s_register_163, s_register_164,
       s_register_165, s_register_166, s_register_167, s_register_168, s_register_169, s_register_170,
       s_register_171, s_register_172, s_register_173, s_register_174, s_register_175, s_register_176,
       s_register_177, status_register_0, status_register_1, status_register_2, status_register_3,
       status_register_4, timestamp00, timestamp01, timestamp02, timestamp03, timestamp04, TLK_Err, veto00,
       veto01, veto02, veto03, veto04, vme_register_1, vme_register_2, vme_register_3, vme_register_4,
       vme_register_5, vme_register_7, vme_register_8;
  wire [31:1] vme_register_6;
  wire [31:4] degub_cabling, degub_fiber;
  wire [231:0] et_dc_err_bus, et_tlk_err_bus, fcdt_out, inst332_q, inst349_q, inst359_q, inst401_q,
       inst402_q, inst403_q, inst468_q, veto_dc_err_bus, veto_err_bus, veto_tlk_err_bus;
  wire [255:0] data, et256, et_data, tset00, tset01, tset02, tset03, tset04, tset05, tset06, tset07, tset08,
       tset09, tset10, tset11, tset12, tset13, tset14, tset15, veto256, veto256_2, veto_data00, veto_data01;

  rraw_sw inst415 (
    .data2x(veto_data01), .data1x(veto_data00), .data0x(et_data), .clock(vmeas), .sel(m_register_64[17:16]),
    .result(data));
  line_dff inst276 (.data(DigIn_AUX), .clock(The_clock), .q(inst276_q));
  PLL_VME inst22 (
    .inclk0(LocalClock), .inclk1(master_clock2), .clkswitch(clkswitch_Local), .c0(vme_clock_125MHz),
    .c2(vme_service_clock));  // open: c1
  altpll00 inst233 (
    .inclk0(master_clock0), .areset(pll_reset), .c0(The_clock), .c1(samplingclock), .c2(inst233_c2),
    .c3(digout_clock), .c4(align_clock), .c5(fanout_clock));
  altpll_fanout inst514 (
    .inclk0(master_clock0), .areset(pll_reset), .c0(fanout_clock_p0), .c1(fanout_clock_p1),
    .c2(fanout_clock_p2), .c3(fanout_clock_p3), .c4(fanout_clock_p4), .c5(fanout_clock_p5));
  altpll_digout inst541 (
    .inclk0(master_clock0), .areset(pll_reset), .c0(digout_clock_p0), .c1(digout_clock_p1),
    .c2(digout_clock_p2), .c3(digout_clock_p3), .c4(digout_clock_p4), .c5(digout_clock_p5));
  altpll_obsolete inst21 (.inclk0(master_clock0), .inclk1(master_clock1), .clkswitch(clkswitch));  // open: c0
  altpll_obsolete inst33 (.inclk0(master_clock3), .inclk1(master_clock4));  // open: clkswitch, c0
  fiber_input_switch inst45 (
    .data1x({16{1'b0}}), .data0x(\0_RXD_Buffered ), .clock(The_clock), .sel(vme_register_2[0]),
    .result(et_first_input));
  fiber_input_switch inst48 (
    .data1x({16{1'b0}}), .data0x(\1_RXD_Buffered ), .clock(The_clock), .sel(vme_register_2[1]),
    .result(inst48_result));
  fiber_input_switch inst323 (
    .data1x({16{1'b0}}), .data0x(\3_RXD_Buffered ), .clock(The_clock), .sel(vme_register_2[2]),
    .result(inst323_result));
  not inst279 (inst279_out, bypass_lv2_buffer_full);
  pipe_input inst96 (
    .clk(The_clock), .in(in_ext_trig[0]), .in_live(led_0), .user_delay(ext0_delay), .out(out_ext_trig00[0]));
  pipe_input inst102 (
    .clk(The_clock), .in(in_ext_trig[1]), .in_live(led_0), .user_delay(ext1_delay), .out(out_ext_trig00[1]));
  pipe_input inst106 (
    .clk(The_clock), .in(in_ext_trig[2]), .in_live(led_0), .user_delay(ext2_delay), .out(out_ext_trig00[2]));
  pipe_input inst103 (
    .clk(The_clock), .in(in_ext_trig[3]), .in_live(led_0), .user_delay(ext3_delay), .out(out_ext_trig00[3]));
  assign ClockSwitchControl = 4'b1111;  // WIRE inst163
  TRI inst134 (.IN(1'b0), .OE(1'b0), .OUT(JC_uW_CLK));
  TRI inst135 (.IN(1'b0), .OE(1'b0), .OUT(JC_uW_DATA));
  TRI inst148 (.IN(1'b0), .OE(1'b0), .OUT(JC_uW_LE));
  TRI inst157 (.IN(1'b0), .OE(1'b0), .OUT(JC_GOE));
  TRI inst164 (.IN(1'b0), .OE(1'b0), .OUT(JC_LD));
  TRI inst165 (.IN(1'b0), .OE(1'b0), .OUT(JC_SYNCn));
  and inst278 (inst278_out, inst276_q, inst279_out);
  assign \0_XCLK  = inst233_c2;  // WIRE inst70
  assign \1_XCLK  = inst233_c2;  // WIRE inst78
  assign \2_XCLK  = inst233_c2;  // WIRE inst83
  assign \3_XCLK  = inst233_c2;  // WIRE inst95
  assign rd_data1[15:0] = data[15:0];  // WIRE inst58
  assign rd_data1[31:16] = data[31:16];  // WIRE inst59
  assign rd_data2[15:0] = data[47:32];  // WIRE inst60
  assign rd_data2[31:16] = data[63:48];  // WIRE inst61
  assign rd_data3[15:0] = data[79:64];  // WIRE inst140
  assign rd_data3[31:16] = data[95:80];  // WIRE inst142
  assign rd_data4[15:0] = data[111:96];  // WIRE inst143
  assign rd_data4[31:16] = data[127:112];  // WIRE inst144
  assign rd_data5[15:0] = data[143:128];  // WIRE inst145
  assign rd_data5[31:16] = data[159:144];  // WIRE inst146
  assign rd_data6[15:0] = data[175:160];  // WIRE inst285
  assign rd_data6[31:16] = data[191:176];  // WIRE inst286
  assign rd_data7[15:0] = data[207:192];  // WIRE inst287
  assign rd_data7[31:16] = data[223:208];  // WIRE inst288
  assign rd_data8[15:0] = data[239:224];  // WIRE inst289
  assign rd_data8[31:16] = data[255:240];  // WIRE inst290
  line_dff inst280 (.data(inst278_out), .clock(The_clock), .q(lv2_buffer_full));
  assign DigOutput_AUX1 = 1'b0;  // WIRE inst50
  assign DigOutput_AUX2 = 1'b0;  // WIRE inst51
  assign DigOutput_AUX3 = 1'b0;  // WIRE inst54
  et_peak_sensing inst71 (
    .clk(The_clock), .in_et(et_first_input), .et_thre(vme_register_8[31:16]), .out_et(et_after_peak_sensing));
  ext_dff01 inst202 (.data(out_ext_trig00), .clock(The_clock), .q(out_ext_trig01));
  time_controller #(.DELAY_ALIGN_TRIG(12500000), .MAX_LOCAL_ALIGN_TIME(12500500), .MAX_GET_DC_ERR_TIME(12501000), .MAX_GLOBAL_ALIGN_TIME(12501500), .SPILL_ON_TIME(12501500), .SPILL_OFF_TIME(350000000)) inst36 (
    .clk(The_clock), .in_live(led_0), .in_et(et_after_peak_sensing), .in_veto0(inst48_result),
    .in_veto1(inst323_result), .tlk_err(is_tlk_err), .dc_err(is_dc_err), .delay_raw(vme_register_4[8:0]),
    .delta_et_thre(m_register_41[15:0]), .delta_veto_ptn(m_register_55), .spill_off_time(m_register_52),
    .bypass_local_align_err(m_register_64[30]), .bypass_global_align_err(m_register_64[31]),
    .status_tlk_err(status_register_0[11]), .status_local_align_err(status_register_0[12]),
    .status_global_align_err(status_register_1[22]), .status_dc_err(status_register_0[13]),
    .status_delay_et_align_ptn(status_register_0[22:14]),
    .status_delay_veto0_align_ptn(status_register_0[31:23]),
    .status_delay_veto1_align_ptn(s_register_149[8:0]), .status_delay_et_delta_ptn(s_register_100[8:0]),
    .status_delay_veto0_delta_ptn(s_register_100[17:9]), .status_delay_veto1_delta_ptn(s_register_149[17:9]),
    .out_adc(inst36_out_adc), .out_veto(inst36_out_veto), .out_et(inst36_out_et), .out_spill(out_spill),
    .out_ena_trig(inst36_out_ena_trig), .out_ena_delta(out_ena_delta), .timestamp(inst36_timestamp));
  vme_interface inst2 (
    .address(address), ._ga(_ga), ._lword(_lword), ._vme_write(_vme_write), .am(am), ._as(_as),
    ._iack(_iack), ._ds(_ds), ._delayed_modsel(_dalayed_modsel_in), ._delayed_ds(_dalayed_ds_in),
    .fromtapdel(fromdel[5:1]), ._modsel(inst2__modsel), ._vme_data_str(transceivers_OE),
    .vme_write(inst2_vme_write), .dir_trans(dir_trans), .vme_address(addr), .totapdel(inst2_totapdel),
    .vmeas(vmeas), .vmeds(inst2_vmeds), ._dtack(_dtack), ._berr(_berr));  // open: vmespare
  assign debug[19:9] = {11{1'b0}};  // WIRE inst3
  assign s_register_174 = {32{1'b0}};  // WIRE inst526
  assign s_register_166 = {32{1'b0}};  // WIRE inst518
  assign s_register_167 = {32{1'b0}};  // WIRE inst519
  assign s_register_168 = {32{1'b0}};  // WIRE inst520
  assign s_register_169 = {32{1'b0}};  // WIRE inst521
  assign s_register_170 = {32{1'b0}};  // WIRE inst522
  assign s_register_171 = {32{1'b0}};  // WIRE inst523
  assign s_register_172 = {32{1'b0}};  // WIRE inst524
  assign s_register_173 = {32{1'b0}};  // WIRE inst525
  assign s_register_151 = {32{1'b0}};  // WIRE inst435
  assign s_register_153 = {32{1'b0}};  // WIRE inst436
  assign s_register_155 = {32{1'b0}};  // WIRE inst437
  assign s_register_157 = {32{1'b0}};  // WIRE inst438
  assign s_register_159 = {32{1'b0}};  // WIRE inst439
  // WIRE inst457 has open pins
  // WIRE inst458 has open pins
  // WIRE inst488 has open pins
  assign Debug_LVDS_OUT_0 = Debug_LVDS_IN_0;  // WIRE inst27
  assign Debug_LVDS_OUT_1 = Debug_LVDS_IN_1;  // WIRE inst20
  assign s_register_108 = {32{1'b0}};  // WIRE inst226
  assign s_register_109 = {32{1'b0}};  // WIRE inst230
  assign s_register_110 = {32{1'b0}};  // WIRE inst231
  assign s_register_111 = {32{1'b0}};  // WIRE inst465
  tapdel10 inst13 (.clock(vme_service_clock), .in(inst2_totapdel), .out(fromdel));
  assign degub_fiber = {28{1'b0}};  // WIRE inst232
  assign degub_cabling = {28{1'b0}};  // WIRE inst242
  line_dff inst299 (.data(inputbus[0]), .clock(The_clock), .q(inst299_q));
  line_dff inst302 (.data(inputbus[1]), .clock(The_clock), .q(inst302_q));
  line_dff inst305 (.data(inputbus[2]), .clock(The_clock), .q(inst305_q));
  line_dff inst309 (.data(inputbus[3]), .clock(The_clock), .q(inst309_q));
  and inst532 (out_ena_trig, inst36_out_ena_trig, tena);
  not inst24 (inst24_out, counter7_out[23]);
  counter7 inst19 (.clock(vme_service_clock), .cnt_en(inst24_out), .aclr(inst23_out), .q(counter7_out));
  trig_type_lv1a_delta inst243 (
    .clk(The_clock), .in_et(et00), .in_veto(veto00), .in_live(led_0), .in_ena(out_ena_delta),
    .user_ena(vme_register_5[16]), .delta_et_thre(m_register_41[15:0]), .delta_veto_ptn(m_register_55),
    .out_lv1a(delta_lv1a00), .et_raw(s_register_145[15:0]), .veto_raw(s_register_147),
    .ndelta(s_register_146[15:0]), .delay_et(status_register_2[28:20]), .delay_veto(s_register_100[26:18]));
  not inst23 (inst23_out, inst2__modsel);
  line_dff inst300 (.data(inst299_q), .clock(The_clock), .q(inst300_q));
  line_dff inst303 (.data(inst302_q), .clock(The_clock), .q(inst303_q));
  line_dff inst306 (.data(inst305_q), .clock(The_clock), .q(inst306_q));
  line_dff inst310 (.data(inst309_q), .clock(The_clock), .q(inst310_q));
  align_trig_dff0 inst224 (.data(inst36_out_adc), .clock(The_clock), .q(inst224_q));
  out_veto_dff inst53 (.data(inst36_out_veto), .clock(The_clock), .q(inst53_q));
  out_et_dff inst63 (.data(inst36_out_et), .clock(The_clock), .q(inst63_q));
  timestamp_dff inst92 (.data(inst36_timestamp), .clock(The_clock), .q(inst92_q));
  trig_type_lv1a_ext inst238 (
    .clk(The_clock), .in_ext(out_ext_trig00[0]), .in_live(led_0), .in_ena(out_ena_trig),
    .in_spill(out_spill), .user_ena(m_register_21[0]), .user_spill_on(m_register_21[4]),
    .user_spill_off(m_register_21[8]), .out_lv1a(inst238_out_lv1a), .raw_cnt(s_register_104[15:0]));
  trig_type_lv1a_ext inst239 (
    .clk(The_clock), .in_ext(out_ext_trig00[1]), .in_live(led_0), .in_ena(out_ena_trig),
    .in_spill(out_spill), .user_ena(m_register_21[1]), .user_spill_on(m_register_21[5]),
    .user_spill_off(m_register_21[9]), .out_lv1a(inst239_out_lv1a), .raw_cnt(s_register_104[31:16]));
  trig_type_lv1a_ext inst240 (
    .clk(The_clock), .in_ext(out_ext_trig00[2]), .in_live(led_0), .in_ena(out_ena_trig),
    .in_spill(out_spill), .user_ena(m_register_21[2]), .user_spill_on(m_register_21[6]),
    .user_spill_off(m_register_21[10]), .out_lv1a(inst240_out_lv1a), .raw_cnt(s_register_105[15:0]));
  trig_type_lv1a_ext inst241 (
    .clk(The_clock), .in_ext(out_ext_trig00[3]), .in_live(led_0), .in_ena(out_ena_trig),
    .in_spill(out_spill), .user_ena(m_register_21[3]), .user_spill_on(m_register_21[7]),
    .user_spill_off(m_register_21[11]), .out_lv1a(inst241_out_lv1a), .raw_cnt(s_register_105[31:16]));
  dff_one inst16 (.data(inst2__modsel), .clock(vme_service_clock), .q(inst16_q));
  dff_one inst14 (.data(transceivers_OE), .clock(vme_service_clock), .q(inst14_q));
  tdc_vme inst57 (
    .vmewrite(inst2_vme_write), .vmeas(vmeas), .vmeds(inst2_vmeds), .id(1'b0), .sysclk(sysclk), .addr(addr),
    .rd_data1(rd_data1), .rd_data2(rd_data2), .rd_data3(rd_data3), .rd_data4(rd_data4), .rd_data5(rd_data5),
    .rd_data6(rd_data6), .rd_data7(rd_data7), .rd_data8(rd_data8), .rd_data9({32{1'b0}}),
    .status_bus0(status_register_0), .status_bus1(status_register_1), .status_bus2(status_register_2),
    .status_bus3(status_register_3), .status_bus4(status_register_4), .status_reg100(s_register_100),
    .status_reg101(s_register_101), .status_reg102(s_register_102), .status_reg103(s_register_103),
    .status_reg104(s_register_104), .status_reg105(s_register_105), .status_reg106(s_register_106),
    .status_reg107(s_register_107), .status_reg108(s_register_108), .status_reg109(s_register_109),
    .status_reg110(s_register_110), .status_reg111(s_register_111), .status_reg112(s_register_112),
    .status_reg113(s_register_113), .status_reg114(s_register_114), .status_reg115(s_register_115),
    .status_reg116(s_register_116), .status_reg117(s_register_117), .status_reg118(s_register_118),
    .status_reg119(s_register_119), .status_reg120(s_register_120), .status_reg121(s_register_121),
    .status_reg122(s_register_122), .status_reg123(s_register_123), .status_reg124(s_register_124),
    .status_reg125(s_register_125), .status_reg126(s_register_126), .status_reg127(s_register_127),
    .status_reg128(s_register_128), .status_reg129(s_register_129), .status_reg130(s_register_130),
    .status_reg131(s_register_131), .status_reg132(s_register_132), .status_reg133(s_register_133),
    .status_reg134(s_register_134), .status_reg135(s_register_135), .status_reg136(s_register_136),
    .status_reg137(s_register_137), .status_reg138(s_register_138), .status_reg139(s_register_139),
    .status_reg140(s_register_140), .status_reg141(s_register_141), .status_reg142(s_register_142),
    .status_reg143(s_register_143), .status_reg144(s_register_144), .status_reg145(s_register_145),
    .status_reg146(s_register_146), .status_reg147(s_register_147), .status_reg148(s_register_148),
    .status_reg149(s_register_149), .status_reg150(s_register_150), .status_reg151(s_register_151),
    .status_reg152(s_register_152), .status_reg153(s_register_153), .status_reg154(s_register_154),
    .status_reg155(s_register_155), .status_reg156(s_register_156), .status_reg157(s_register_157),
    .status_reg158(s_register_158), .status_reg159(s_register_159), .status_reg160(s_register_160),
    .status_reg161(s_register_161), .status_reg162(s_register_162), .status_reg163(s_register_163),
    .status_reg164(s_register_164), .status_reg165(s_register_165), .status_reg166(s_register_166),
    .status_reg167(s_register_167), .status_reg168(s_register_168), .status_reg169(s_register_169),
    .status_reg170(s_register_170), .status_reg171(s_register_171), .status_reg172(s_register_172),
    .status_reg173(s_register_173), .status_reg174(s_register_174), .status_reg175(s_register_175),
    .status_reg176(s_register_176), .status_reg177(s_register_177), .status_reg178({32{1'b0}}),
    .status_reg179({32{1'b0}}), .status_reg180({32{1'b0}}), .test_mode(inst57_test_mode),
    .reset(inst57_reset), .test_data_mode(inst57_test_data_mode), .SPI_start(inst57_spi_start),
    .vmel2a_mode(inst57_vmel2a_mode), .reset1(inst57_reset1), .halt_mode(inst57_halt_mode),
    .vme_wr_en1(inst57_vme_wr_en1), .vme_wr_en2(inst57_vme_wr_en2), .vme_wr_en3(inst57_vme_wr_en3),
    .vme_wr_en4(inst57_vme_wr_en4), .vme_wr_en5(inst57_vme_wr_en5), .vme_wr_en6(inst57_vme_wr_en6),
    .vme_wr_en7(inst57_vme_wr_en7), .vme_wr_en8(inst57_vme_wr_en8), .register1(inst57_register1),
    .register2(inst57_register2), .register3(inst57_register3), .register4(inst57_register4),
    .register5(inst57_register5), .register6(inst57_register6), .register7(inst57_register7),
    .register8(inst57_register8), .reg20(inst57_reg20), .reg21(inst57_reg21), .reg22(inst57_reg22),
    .reg23(inst57_reg23), .reg24(inst57_reg24), .reg25(inst57_reg25), .reg26(inst57_reg26),
    .reg27(inst57_reg27), .reg28(inst57_reg28), .reg29(inst57_reg29), .reg30(inst57_reg30),
    .reg31(inst57_reg31), .reg32(inst57_reg32), .reg33(inst57_reg33), .reg34(inst57_reg34),
    .reg35(inst57_reg35), .reg36(inst57_reg36), .reg37(inst57_reg37), .reg38(inst57_reg38),
    .reg39(inst57_reg39), .reg40(inst57_reg40), .reg41(inst57_reg41), .reg42(inst57_reg42),
    .reg43(inst57_reg43), .reg44(inst57_reg44), .reg45(inst57_reg45), .reg46(inst57_reg46),
    .reg47(inst57_reg47), .reg48(inst57_reg48), .reg49(inst57_reg49), .reg50(inst57_reg50),
    .reg51(inst57_reg51), .reg52(inst57_reg52), .reg53(inst57_reg53), .reg54(inst57_reg54),
    .reg55(inst57_reg55), .reg56(inst57_reg56), .reg57(inst57_reg57), .reg58(inst57_reg58),
    .reg59(inst57_reg59), .reg60(inst57_reg60), .reg61(inst57_reg61), .reg62(inst57_reg62),
    .reg63(inst57_reg63), .reg64(inst57_reg64), .reg65(inst57_reg65), .reg66(inst57_reg66),
    .reg67(inst57_reg67), .reg68(inst57_reg68), .reg69(inst57_reg69), .reg70(inst57_reg70),
    .reg71(inst57_reg71), .reg72(inst57_reg72), .reg73(inst57_reg73), .reg74(inst57_reg74), .data(vme_data));
  line_dff inst301 (.data(inst300_q), .clock(The_clock), .q(inst301_q));
  line_dff inst304 (.data(inst303_q), .clock(The_clock), .q(inst304_q));
  line_dff inst308 (.data(inst306_q), .clock(The_clock), .q(inst308_q));
  line_dff inst311 (.data(inst310_q), .clock(The_clock), .q(inst311_q));
  dff_one inst17 (.data(inst16_q), .clock(vme_service_clock), .q(_dalayed_modsel_in));
  dff_one inst15 (.data(inst14_q), .clock(vme_service_clock), .q(_dalayed_ds_in));
  VME_thing inst69 (
    .In1(inst57_test_mode), .In2(inst57_reset), .In3(inst57_test_data_mode), .In4(inst57_spi_start),
    .In5(inst57_vmel2a_mode), .In6(inst57_reset1), .In15(inst57_halt_mode), .In16(inst57_vme_wr_en1),
    .In17(inst57_vme_wr_en2), .In18(inst57_vme_wr_en3), .In19(inst57_vme_wr_en4), .In20(inst57_vme_wr_en5),
    .In21(inst57_vme_wr_en6), .In22(inst57_vme_wr_en7), .In23(inst57_vme_wr_en8), .In30(inst57_register1),
    .In31(inst57_register2), .In32(inst57_register3), .In33(inst57_register4), .In34(inst57_register5),
    .In35(inst57_register6), .In36(inst57_register7), .In37(inst57_register8), .In38(inst57_reg20),
    .In39(inst57_reg21), .In40(inst57_reg22), .In41(inst57_reg23), .In42(inst57_reg24), .In43(inst57_reg25),
    .In44(inst57_reg26), .In45(inst57_reg27), .In46(inst57_reg28), .In47(inst57_reg29), .In48(inst57_reg30),
    .In49(inst57_reg31), .In50(inst57_reg32), .In51(inst57_reg33), .In52(inst57_reg34), .In53(inst57_reg35),
    .In54(inst57_reg36), .In55(inst57_reg37), .In56(inst57_reg38), .In57(inst57_reg39), .In58(inst57_reg40),
    .In59(inst57_reg41), .In60(inst57_reg42), .In61(inst57_reg43), .In62(inst57_reg44), .In63(inst57_reg45),
    .In64(inst57_reg46), .In65(inst57_reg47), .In66(inst57_reg48), .In67(inst57_reg49), .In68(inst57_reg50),
    .In69(inst57_reg51), .In70(inst57_reg52), .In71(inst57_reg53), .In72(inst57_reg54), .In73(inst57_reg55),
    .In74(inst57_reg56), .In75(inst57_reg57), .In76(inst57_reg58), .In77(inst57_reg59), .In78(inst57_reg60),
    .In79(inst57_reg61), .In80(inst57_reg62), .In81(inst57_reg63), .In82(inst57_reg64), .In83(inst57_reg65),
    .In84(inst57_reg66), .In85(inst57_reg67), .In86(inst57_reg68), .In87(inst57_reg69), .In88(inst57_reg70),
    .In89(inst57_reg71), .In90(inst57_reg72), .In91(inst57_reg73), .In92(inst57_reg74),
    .Outclk1(vme_service_clock), .Out1(vme_halt), .Out2(reset), .Out3(trigger_active), .Out4(Tx_Sel),
    .Out5(live_bypass), .Out6(reset_pll), .Out30(vme_register_1), .Out31(vme_register_2),
    .Out32(vme_register_3), .Out33(vme_register_4), .Out34(vme_register_5),
    .Out35({vme_register_6, DigOutput}), .Out36(vme_register_7), .Out37(vme_register_8),
    .Out38(m_register_20), .Out39(m_register_21), .Out40(m_register_22), .Out41(m_register_23),
    .Out42(m_register_24), .Out43(m_register_25), .Out44(m_register_26), .Out45(m_register_27),
    .Out46(m_register_28), .Out47(m_register_29), .Out48(m_register_30), .Out49(m_register_31),
    .Out50(m_register_32), .Out51(m_register_33), .Out52(m_register_34), .Out53(m_register_35),
    .Out54(m_register_36), .Out55(m_register_37), .Out56(m_register_38), .Out57(m_register_39),
    .Out58(m_register_40), .Out59(m_register_41), .Out60(m_register_42), .Out61(m_register_43),
    .Out62(m_register_44), .Out63(m_register_45), .Out64(m_register_46), .Out65(m_register_47),
    .Out66(m_register_48), .Out67(m_register_49), .Out68(m_register_50), .Out69(m_register_51),
    .Out70(m_register_52), .Out71(m_register_53), .Out72(m_register_54), .Out73(m_register_55),
    .Out74(m_register_56), .Out75(m_register_57), .Out76(m_register_58), .Out77(m_register_59),
    .Out78(m_register_60), .Out79(m_register_61), .Out80(m_register_62), .Out81(m_register_63),
    .Out82(m_register_64), .Out83(m_register_65), .Out84(m_register_66), .Out85(m_register_67),
    .Out86(m_register_68), .Out87(m_register_69), .Out88(m_register_70), .Out89(m_register_71),
    .Out90(m_register_72), .Out91(m_register_73), .Out92(m_register_74));  // open: Out15, Out16, Out17, Out18, Out19, Out20, Out21, Out22, Out23
  align_trig_dff0 inst277 (.data(inst224_q), .clock(The_clock), .q(trig_output00));
  out_veto_dff inst317 (.data(inst53_q), .clock(The_clock), .q(veto00));
  out_et_dff inst318 (.data(inst63_q), .clock(The_clock), .q(et00));
  timestamp_dff inst325 (.data(inst92_q), .clock(The_clock), .q(timestamp00));
  ext_dff02 inst246 (.data(inst238_out_lv1a), .clock(The_clock), .q(ext_lv1a01[0]));
  ext_dff02 inst247 (.data(inst239_out_lv1a), .clock(The_clock), .q(ext_lv1a01[1]));
  ext_dff02 inst248 (.data(inst240_out_lv1a), .clock(The_clock), .q(ext_lv1a01[2]));
  ext_dff02 inst249 (.data(inst241_out_lv1a), .clock(The_clock), .q(ext_lv1a01[3]));
  et_err #(.LENGTH_ERR(232)) inst307 (
    .clk(The_clock), .in_live(led_0), .in_err(inst301_q), .bypass(m_register_64[0]),
    .got_tlk_err_bus(got_et_tlk_err), .got_dc_err_bus(got_et_dc_err), .out_tlk_err_bus(et_tlk_err_bus),
    .out_dc_err_bus(et_dc_err_bus));
  LVDS_RX_Debug inst91 (.clk(The_clock), .rst(reset), .in(inst301_q), .err_cnt(lvds_err_cnt0));
  et_err #(.LENGTH_ERR(232)) inst467 (
    .clk(The_clock), .in_live(led_0), .in_err(inst304_q), .bypass(m_register_64[1]),
    .got_tlk_err_bus(got_veto_tlk_err), .got_dc_err_bus(got_veto_dc_err), .out_tlk_err_bus(veto_tlk_err_bus),
    .out_dc_err_bus(veto_dc_err_bus));
  LVDS_RX_Debug inst160 (.clk(The_clock), .rst(reset), .in(inst304_q), .err_cnt(lvds_err_cnt1));
  et_ofc_err #(.LENGTH_ERR_TLK(18), .LENGTH_ERR_DC(20)) inst56 (
    .clk(The_clock), .in_live(led_0), .in_err(inst308_q), .bypass(m_register_64[2]),
    .got_tlk_err_bus(got_et_ofc_tlk_err), .got_dc_err_bus(got_et_ofc_dc_err),
    .out_tlk_err_bus(et_ofc_tlk_err_bus), .out_dc_err_bus(et_ofc_dc_err_bus));
  LVDS_RX_Debug inst161 (.clk(The_clock), .rst(reset), .in(inst308_q), .err_cnt(lvds_err_cnt2));
  clus_ofc_err #(.LENGTH_ERR(18)) inst294 (
    .clk(The_clock), .in_live(led_0), .in_err(inst311_q), .bypass(m_register_64[3]),
    .got_tlk_err_bus(got_clus_ofc_tlk_err), .out_tlk_err_bus(clus_ofc_tlk_err_bus));
  LVDS_RX_Debug inst162 (.clk(The_clock), .rst(reset), .in(inst311_q), .err_cnt(lvds_err_cnt3));
  demux_bus256_1to16 inst528 (
    .clk(vme_service_clock), .en(vme_halt), .sw(vme_register_1[3:0]), .reg0(m_register_22),
    .reg1(m_register_23), .reg2(m_register_24), .reg3(m_register_25), .reg4(m_register_26),
    .reg5(m_register_27), .reg6(m_register_28), .reg7(m_register_29), .out_00(tset00), .out_01(tset01),
    .out_02(tset02), .out_03(tset03), .out_04(tset04), .out_05(tset05), .out_06(tset06), .out_07(tset07),
    .out_08(tset08), .out_09(tset09), .out_10(tset10), .out_11(tset11), .out_12(tset12), .out_13(tset13),
    .out_14(tset14), .out_15(tset15));
  show_counter inst18 (.clock(vme_service_clock), .q(test_counter));
  show_counter inst7 (.clock(vme_service_clock), .q(show_counter));
  lpm_counter100 inst38 (.clock(The_clock), .q(led_counter));
  assign led_2 = led_counter[23];  // WIRE inst11
  not inst26 (led_1, vme_halt);
  assign s_register_136[15:0] = lvds_err_cnt0;  // WIRE inst395
  assign s_register_136[31:16] = lvds_err_cnt1;  // WIRE inst396
  assign s_register_137[15:0] = lvds_err_cnt2;  // WIRE inst397
  assign s_register_137[31:16] = lvds_err_cnt3;  // WIRE inst398
  assign status_register_2[31] = lv2_buffer_full;  // WIRE inst461
  assign debug[8] = sysclk;  // WIRE inst6
  assign ena_lvds_cnt_debug = vme_register_5[9];  // WIRE inst228
  assign ext0_delay = m_register_20[7:0];  // WIRE inst234
  assign ext1_delay = m_register_20[15:8];  // WIRE inst235
  assign ext2_delay = m_register_20[23:16];  // WIRE inst236
  assign ext3_delay = m_register_20[31:24];  // WIRE inst237
  assign bypass_lv2_buffer_full = vme_register_5[30];  // WIRE inst281
  trig_type_lv1a inst111 (
    .clk(The_clock), .in_et(et00), .in_veto(veto00), .in_live(led_0), .in_ena(out_ena_trig),
    .in_spill(out_spill), .user_et(tset00[49]), .user_veto(tset00[95:64]),
    .user_veto_as_trig(tset00[127:96]), .user_and_or(tset00[50]), .user_ena(tset00[48]),
    .user_spill_on(tset00[51]), .user_spill_off(tset00[52]), .user_prescale_p(tset00[15:0]),
    .user_prescale_q(tset00[31:16]), .user_et_thre(tset00[47:32]), .out_lv1a_raw(out_lv1a_raw[0]),
    .out_lv1a_scaled(out_lv1a_scaled[0]), .scaled_cnt(lv1a_cnt_00));
  trig_type_lv1a inst158 (
    .clk(The_clock), .in_et(et00), .in_veto(veto00), .in_live(led_0), .in_ena(out_ena_trig),
    .in_spill(out_spill), .user_et(tset01[49]), .user_veto(tset01[95:64]),
    .user_veto_as_trig(tset01[127:96]), .user_and_or(tset01[50]), .user_ena(tset01[48]),
    .user_spill_on(tset01[51]), .user_spill_off(tset01[52]), .user_prescale_p(tset01[15:0]),
    .user_prescale_q(tset01[31:16]), .user_et_thre(tset01[47:32]), .out_lv1a_raw(out_lv1a_raw[1]),
    .out_lv1a_scaled(out_lv1a_scaled[1]), .scaled_cnt(lv1a_cnt_01));
  trig_type_lv1a inst173 (
    .clk(The_clock), .in_et(et00), .in_veto(veto00), .in_live(led_0), .in_ena(out_ena_trig),
    .in_spill(out_spill), .user_et(tset02[49]), .user_veto(tset02[95:64]),
    .user_veto_as_trig(tset02[127:96]), .user_and_or(tset02[50]), .user_ena(tset02[48]),
    .user_spill_on(tset02[51]), .user_spill_off(tset02[52]), .user_prescale_p(tset02[15:0]),
    .user_prescale_q(tset02[31:16]), .user_et_thre(tset02[47:32]), .out_lv1a_raw(out_lv1a_raw[2]),
    .out_lv1a_scaled(out_lv1a_scaled[2]), .scaled_cnt(lv1a_cnt_02));
  trig_type_lv1a inst174 (
    .clk(The_clock), .in_et(et00), .in_veto(veto00), .in_live(led_0), .in_ena(out_ena_trig),
    .in_spill(out_spill), .user_et(tset03[49]), .user_veto(tset03[95:64]),
    .user_veto_as_trig(tset03[127:96]), .user_and_or(tset03[50]), .user_ena(tset03[48]),
    .user_spill_on(tset03[51]), .user_spill_off(tset03[52]), .user_prescale_p(tset03[15:0]),
    .user_prescale_q(tset03[31:16]), .user_et_thre(tset03[47:32]), .out_lv1a_raw(out_lv1a_raw[3]),
    .out_lv1a_scaled(out_lv1a_scaled[3]), .scaled_cnt(lv1a_cnt_03));
  trig_type_lv1a inst185 (
    .clk(The_clock), .in_et(et00), .in_veto(veto00), .in_live(led_0), .in_ena(out_ena_trig),
    .in_spill(out_spill), .user_et(tset04[49]), .user_veto(tset04[95:64]),
    .user_veto_as_trig(tset04[127:96]), .user_and_or(tset04[50]), .user_ena(tset04[48]),
    .user_spill_on(tset04[51]), .user_spill_off(tset04[52]), .user_prescale_p(tset04[15:0]),
    .user_prescale_q(tset04[31:16]), .user_et_thre(tset04[47:32]), .out_lv1a_raw(out_lv1a_raw[4]),
    .out_lv1a_scaled(out_lv1a_scaled[4]), .scaled_cnt(lv1a_cnt_04));
  trig_type_lv1a inst183 (
    .clk(The_clock), .in_et(et00), .in_veto(veto00), .in_live(led_0), .in_ena(out_ena_trig),
    .in_spill(out_spill), .user_et(tset05[49]), .user_veto(tset05[95:64]),
    .user_veto_as_trig(tset05[127:96]), .user_and_or(tset05[50]), .user_ena(tset05[48]),
    .user_spill_on(tset05[51]), .user_spill_off(tset05[52]), .user_prescale_p(tset05[15:0]),
    .user_prescale_q(tset05[31:16]), .user_et_thre(tset05[47:32]), .out_lv1a_raw(out_lv1a_raw[5]),
    .out_lv1a_scaled(out_lv1a_scaled[5]), .scaled_cnt(lv1a_cnt_05));
  trig_type_lv1a inst180 (
    .clk(The_clock), .in_et(et00), .in_veto(veto00), .in_live(led_0), .in_ena(out_ena_trig),
    .in_spill(out_spill), .user_et(tset06[49]), .user_veto(tset06[95:64]),
    .user_veto_as_trig(tset06[127:96]), .user_and_or(tset06[50]), .user_ena(tset06[48]),
    .user_spill_on(tset06[51]), .user_spill_off(tset06[52]), .user_prescale_p(tset06[15:0]),
    .user_prescale_q(tset06[31:16]), .user_et_thre(tset06[47:32]), .out_lv1a_raw(out_lv1a_raw[6]),
    .out_lv1a_scaled(out_lv1a_scaled[6]), .scaled_cnt(lv1a_cnt_06));
  trig_type_lv1a inst200 (
    .clk(The_clock), .in_et(et00), .in_veto(veto00), .in_live(led_0), .in_ena(out_ena_trig),
    .in_spill(out_spill), .user_et(tset07[49]), .user_veto(tset07[95:64]),
    .user_veto_as_trig(tset07[127:96]), .user_and_or(tset07[50]), .user_ena(tset07[48]),
    .user_spill_on(tset07[51]), .user_spill_off(tset07[52]), .user_prescale_p(tset07[15:0]),
    .user_prescale_q(tset07[31:16]), .user_et_thre(tset07[47:32]), .out_lv1a_raw(out_lv1a_raw[7]),
    .out_lv1a_scaled(out_lv1a_scaled[7]), .scaled_cnt(lv1a_cnt_07));
  trig_type_lv1a inst156 (
    .clk(The_clock), .in_et(et00), .in_veto(veto00), .in_live(led_0), .in_ena(out_ena_trig),
    .in_spill(out_spill), .user_et(tset08[49]), .user_veto(tset08[95:64]),
    .user_veto_as_trig(tset08[127:96]), .user_and_or(tset08[50]), .user_ena(tset08[48]),
    .user_spill_on(tset08[51]), .user_spill_off(tset08[52]), .user_prescale_p(tset08[15:0]),
    .user_prescale_q(tset08[31:16]), .user_et_thre(tset08[47:32]), .out_lv1a_raw(out_lv1a_raw[8]),
    .out_lv1a_scaled(out_lv1a_scaled[8]), .scaled_cnt(lv1a_cnt_08));
  trig_type_lv1a inst159 (
    .clk(The_clock), .in_et(et00), .in_veto(veto00), .in_live(led_0), .in_ena(out_ena_trig),
    .in_spill(out_spill), .user_et(tset09[49]), .user_veto(tset09[95:64]),
    .user_veto_as_trig(tset09[127:96]), .user_and_or(tset09[50]), .user_ena(tset09[48]),
    .user_spill_on(tset09[51]), .user_spill_off(tset09[52]), .user_prescale_p(tset09[15:0]),
    .user_prescale_q(tset09[31:16]), .user_et_thre(tset09[47:32]), .out_lv1a_raw(out_lv1a_raw[9]),
    .out_lv1a_scaled(out_lv1a_scaled[9]), .scaled_cnt(lv1a_cnt_09));
  trig_type_lv1a inst245 (
    .clk(The_clock), .in_et(et00), .in_veto(veto00), .in_live(led_0), .in_ena(out_ena_trig),
    .in_spill(out_spill), .user_et(tset10[49]), .user_veto(tset10[95:64]),
    .user_veto_as_trig(tset10[127:96]), .user_and_or(tset10[50]), .user_ena(tset10[48]),
    .user_spill_on(tset10[51]), .user_spill_off(tset10[52]), .user_prescale_p(tset10[15:0]),
    .user_prescale_q(tset10[31:16]), .user_et_thre(tset10[47:32]), .out_lv1a_raw(out_lv1a_raw[10]),
    .out_lv1a_scaled(out_lv1a_scaled[10]), .scaled_cnt(lv1a_cnt_10));
  trig_type_lv1a inst254 (
    .clk(The_clock), .in_et(et00), .in_veto(veto00), .in_live(led_0), .in_ena(out_ena_trig),
    .in_spill(out_spill), .user_et(tset11[49]), .user_veto(tset11[95:64]),
    .user_veto_as_trig(tset11[127:96]), .user_and_or(tset11[50]), .user_ena(tset11[48]),
    .user_spill_on(tset11[51]), .user_spill_off(tset11[52]), .user_prescale_p(tset11[15:0]),
    .user_prescale_q(tset11[31:16]), .user_et_thre(tset11[47:32]), .out_lv1a_raw(out_lv1a_raw[11]),
    .out_lv1a_scaled(out_lv1a_scaled[11]), .scaled_cnt(lv1a_cnt_11));
  trig_type_lv1a inst327 (
    .clk(The_clock), .in_et(et00), .in_veto(veto00), .in_live(led_0), .in_ena(out_ena_trig),
    .in_spill(out_spill), .user_et(tset12[49]), .user_veto(tset12[95:64]),
    .user_veto_as_trig(tset12[127:96]), .user_and_or(tset12[50]), .user_ena(tset12[48]),
    .user_spill_on(tset12[51]), .user_spill_off(tset12[52]), .user_prescale_p(tset12[15:0]),
    .user_prescale_q(tset12[31:16]), .user_et_thre(tset12[47:32]), .out_lv1a_raw(out_lv1a_raw[12]),
    .out_lv1a_scaled(out_lv1a_scaled[12]), .scaled_cnt(lv1a_cnt_12));
  trig_type_lv1a inst315 (
    .clk(The_clock), .in_et(et00), .in_veto(veto00), .in_live(led_0), .in_ena(out_ena_trig),
    .in_spill(out_spill), .user_et(tset13[49]), .user_veto(tset13[95:64]),
    .user_veto_as_trig(tset13[127:96]), .user_and_or(tset13[50]), .user_ena(tset13[48]),
    .user_spill_on(tset13[51]), .user_spill_off(tset13[52]), .user_prescale_p(tset13[15:0]),
    .user_prescale_q(tset13[31:16]), .user_et_thre(tset13[47:32]), .out_lv1a_raw(out_lv1a_raw[13]),
    .out_lv1a_scaled(out_lv1a_scaled[13]), .scaled_cnt(lv1a_cnt_13));
  trig_type_lv1a inst413 (
    .clk(The_clock), .in_et(et00), .in_veto(veto00), .in_live(led_0), .in_ena(out_ena_trig),
    .in_spill(out_spill), .user_et(tset14[49]), .user_veto(tset14[95:64]),
    .user_veto_as_trig(tset14[127:96]), .user_and_or(tset14[50]), .user_ena(tset14[48]),
    .user_spill_on(tset14[51]), .user_spill_off(tset14[52]), .user_prescale_p(tset14[15:0]),
    .user_prescale_q(tset14[31:16]), .user_et_thre(tset14[47:32]), .out_lv1a_raw(out_lv1a_raw[14]),
    .out_lv1a_scaled(out_lv1a_scaled[14]), .scaled_cnt(lv1a_cnt_14));
  trig_type_lv1a inst407 (
    .clk(The_clock), .in_et(et00), .in_veto(veto00), .in_live(led_0), .in_ena(out_ena_trig),
    .in_spill(out_spill), .user_et(tset15[49]), .user_veto(tset15[95:64]),
    .user_veto_as_trig(tset15[127:96]), .user_and_or(tset15[50]), .user_ena(tset15[48]),
    .user_spill_on(tset15[51]), .user_spill_off(tset15[52]), .user_prescale_p(tset15[15:0]),
    .user_prescale_q(tset15[31:16]), .user_et_thre(tset15[47:32]), .out_lv1a_raw(out_lv1a_raw[15]),
    .out_lv1a_scaled(out_lv1a_scaled[15]), .scaled_cnt(lv1a_cnt_15));
  line_dff inst330 (.data(got_et_tlk_err), .clock(The_clock), .q(got_et_tlk_err00));
  raw_err_dff inst332 (.data(et_tlk_err_bus), .clock(The_clock), .enable(got_et_tlk_err), .q(inst332_q));
  raw_err_dff inst349 (.data(et_dc_err_bus), .clock(The_clock), .enable(got_et_dc_err), .q(inst349_q));
  line_dff inst351 (.data(got_et_ofc_tlk_err), .clock(The_clock), .q(got_et_ofc_tlk_err00));
  ofc_err_dff inst356 (.data(et_ofc_tlk_err_bus), .clock(The_clock), .enable(got_et_ofc_tlk_err), .q(inst356_q));
  bus20_dff inst217 (.data(et_ofc_dc_err_bus), .clock(The_clock), .enable(got_et_ofc_dc_err), .q(inst217_q));
  raw_err_dff inst403 (.data(veto_err_bus), .clock(The_clock), .enable(got_veto_dc_err), .q(inst403_q));
  raw_err_dff inst402 (.data(et_dc_err_bus), .clock(The_clock), .enable(got_et_dc_err), .q(inst402_q));
  raw_err_dff inst401 (.data(et_tlk_err_bus), .clock(The_clock), .enable(got_et_tlk_err), .q(inst401_q));
  lpm_dff7 inst344 (.data(\2_RXD_Buffered ), .clock(The_clock), .q(inst344_q));
  lpm_dff7 inst348 (.data(\3_RXD_Buffered ), .clock(The_clock), .q(inst348_q));
  GLINK_fifo inst177 (
    .data(\2_RXD ), .wrreq(1'b1), .wrclk(\2_RX_CLK ), .rdreq(1'b1), .rdclk(The_clock), .q(\2_RXD_Buffered ));
  GLINK_fifo inst178 (
    .data(\3_RXD ), .wrreq(1'b1), .wrclk(\3_RX_CLK ), .rdreq(1'b1), .rdclk(The_clock), .q(\3_RXD_Buffered ));
  lpm_add_sub18 inst343 (.dataa(\2_RXD_Buffered ), .datab(inst344_q), .clock(The_clock), .result(inst343_result));
  lpm_add_sub18 inst347 (.dataa(\3_RXD_Buffered ), .datab(inst348_q), .clock(The_clock), .result(inst347_result));
  OL_Controller inst188 (
    .clk(The_clock), .LIVE(led_0), .data_tx(trig_tag_output), .data_rx(\2_RXD_Buffered ),
    .ena_rx(vme_register_8[2]), .data_out(inst188_data_out), .ena_tx(inst188_ena_tx), .error(inst188_error),
    .send_err(got_olrx[2]));  // open: datak
  OL_Controller inst212 (
    .clk(The_clock), .LIVE(led_0), .data_tx(trig_tag_output), .data_rx(\3_RXD_Buffered ),
    .ena_rx(vme_register_8[3]), .data_out(inst212_data_out), .ena_tx(inst212_ena_tx), .error(inst212_error),
    .send_err(got_olrx[3]));  // open: datak
  st232_mux inst87 (
    .data2x(inst403_q), .data1x(inst402_q), .data0x(inst401_q), .clock(The_clock),
    .sel(vme_register_4[19:18]), .result(fcdt_out));
  line_dff inst466 (.data(delta_lv1a00), .clock(The_clock), .q(delta_lv1a01));
  dff16 inst250 (.data(out_lv1a_scaled), .clock(The_clock), .q(inst250_q));
  timestamp_dff01 inst263 (.data(timestamp00), .clock(The_clock), .q(inst263_q));
  et_dff inst251 (.data(et00[15:0]), .clock(The_clock), .q(inst251_q));
  veto_dff inst253 (.data(veto00), .clock(The_clock), .q(inst253_q));
  lpm_compare27 inst342 (.dataa(inst343_result), .clock(The_clock), .aneb(inst342_aneb));
  bus32_mux16 inst529 (
    .data15x(lv1a_cnt_15), .data14x(lv1a_cnt_14), .data13x(lv1a_cnt_13), .data12x(lv1a_cnt_12),
    .data11x(lv1a_cnt_11), .data10x(lv1a_cnt_10), .data9x(lv1a_cnt_09), .data8x(lv1a_cnt_08),
    .data7x(lv1a_cnt_07), .data6x(lv1a_cnt_06), .data5x(lv1a_cnt_05), .data4x(lv1a_cnt_04),
    .data3x(lv1a_cnt_03), .data2x(lv1a_cnt_02), .data1x(lv1a_cnt_01), .data0x(lv1a_cnt_00),
    .clock(vme_service_clock), .sel(vme_register_1[3:0]), .result(s_register_165));
  lpm_compare27 inst346 (.dataa(inst347_result), .clock(The_clock), .aneb(inst346_aneb));
  nclus_in_switch inst73 (
    .data1x({16{1'b0}}), .data0x(\2_RXD_Buffered ), .clock(The_clock), .sel(vme_register_5[18]),
    .result(inst73_result));
  stat_veto inst55 (.clk(The_clock), .in_live(led_0), .in_veto(veto00[0]), .veto_cnt(s_register_103));
  stat_veto inst129 (.clk(The_clock), .in_live(led_0), .in_veto(veto00[1]), .veto_cnt(s_register_123));
  stat_veto inst223 (.clk(The_clock), .in_live(led_0), .in_veto(veto00[2]), .veto_cnt(s_register_124));
  stat_veto inst227 (.clk(The_clock), .in_live(led_0), .in_veto(veto00[3]), .veto_cnt(s_register_125));
  stat_veto inst283 (.clk(The_clock), .in_live(led_0), .in_veto(veto00[4]), .veto_cnt(s_register_126));
  stat_veto inst284 (.clk(The_clock), .in_live(led_0), .in_veto(veto00[5]), .veto_cnt(s_register_127));
  stat_veto inst380 (.clk(The_clock), .in_live(led_0), .in_veto(veto00[6]), .veto_cnt(s_register_128));
  stat_veto inst388 (.clk(The_clock), .in_live(led_0), .in_veto(veto00[7]), .veto_cnt(s_register_129));
  line_dff inst331 (.data(got_et_dc_err), .clock(The_clock), .q(got_et_dc_err00));
  et_err_decoder inst329 (
    .clk(The_clock), .in_live(led_0), .got_tlk_err(got_et_tlk_err00), .got_dc_err(got_et_dc_err00),
    .tlk_err_bus(inst332_q), .dc_err_bus(inst349_q), .is_tlk_err(is_et_tlk_err), .is_dc_err(is_et_dc_err));
  line_dff inst352 (.data(got_et_ofc_dc_err), .clock(The_clock), .q(got_et_ofc_dc_err00));
  et_ofc_err_decoder inst350 (
    .clk(The_clock), .in_live(led_0), .got_tlk_err(got_et_ofc_tlk_err00), .got_dc_err(got_et_ofc_dc_err00),
    .tlk_err_bus(inst356_q), .dc_err_bus(inst217_q), .is_tlk_err(is_et_ofc_tlk_err),
    .is_dc_err(is_et_ofc_dc_err));
  timestamp_dff01 inst265 (.data(inst263_q), .clock(The_clock), .q(inst265_q));
